# Altium schematic sheet STALO_1.SchDoc: STALO_1 (part 1 of 2)
size D; Date: 09-24-10; DrawnBy: C. Lewis; Engineer: C. Lewis; Address1: 4650 NORRIS CANYON RD.; Address2: SAN RAMON, CA 94583; DocumentNumber: 35133; Revision: D; SheetNumber: 18; SheetTotal: 20; PageSetup: Record=PageOptions|CenterHorizontal=True|CenterVertical=True|PrintScale=0.51|XCorrection=1.00|YCorrection=1.00|PrintKind=1|BorderSize=5000000|LeftOffset=0|BottomOffset=0|Orientation=2|PaperLength=1000|PaperWidth=1000|Scale=100|PaperSource=15|PrintQuality=600|MediaType=1|DitherType=10|PaperKind=11x17|PrintScaleMode=1; DocumentName: Sheet1.SCHDOC; ModifiedDate: 10-27-11
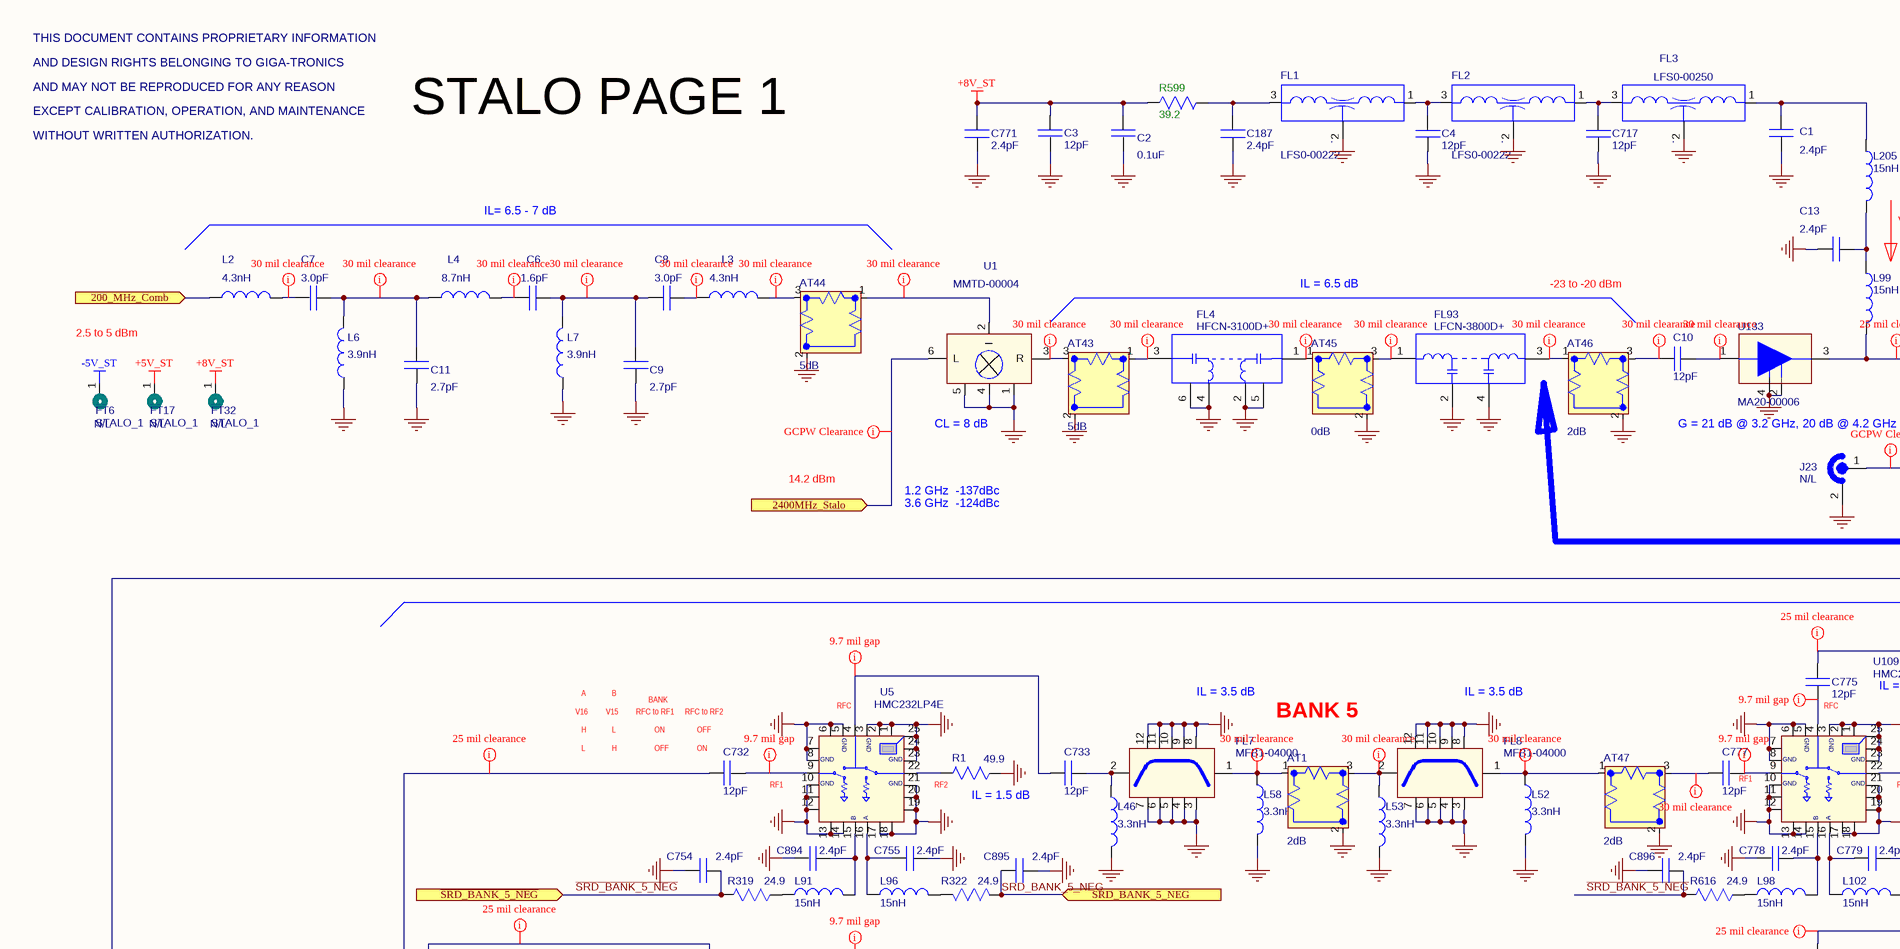
[diagram p0: STALO_1.SchDoc, top left]
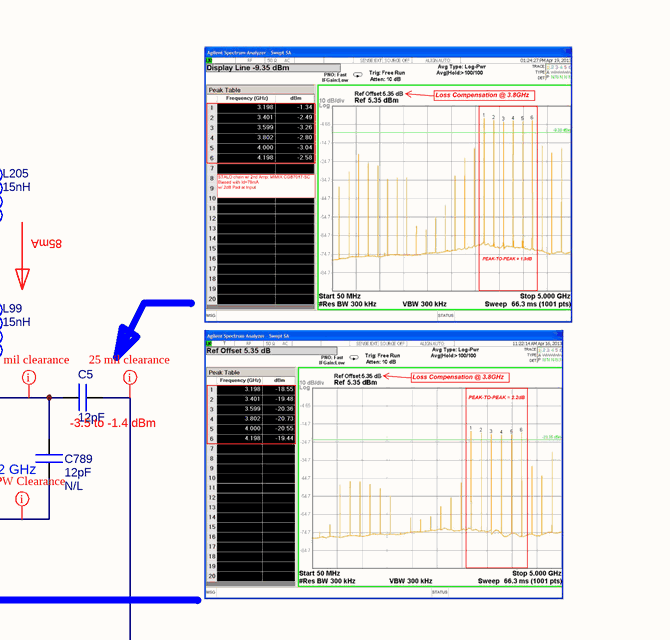
[diagram p1: STALO_1.SchDoc, top right]
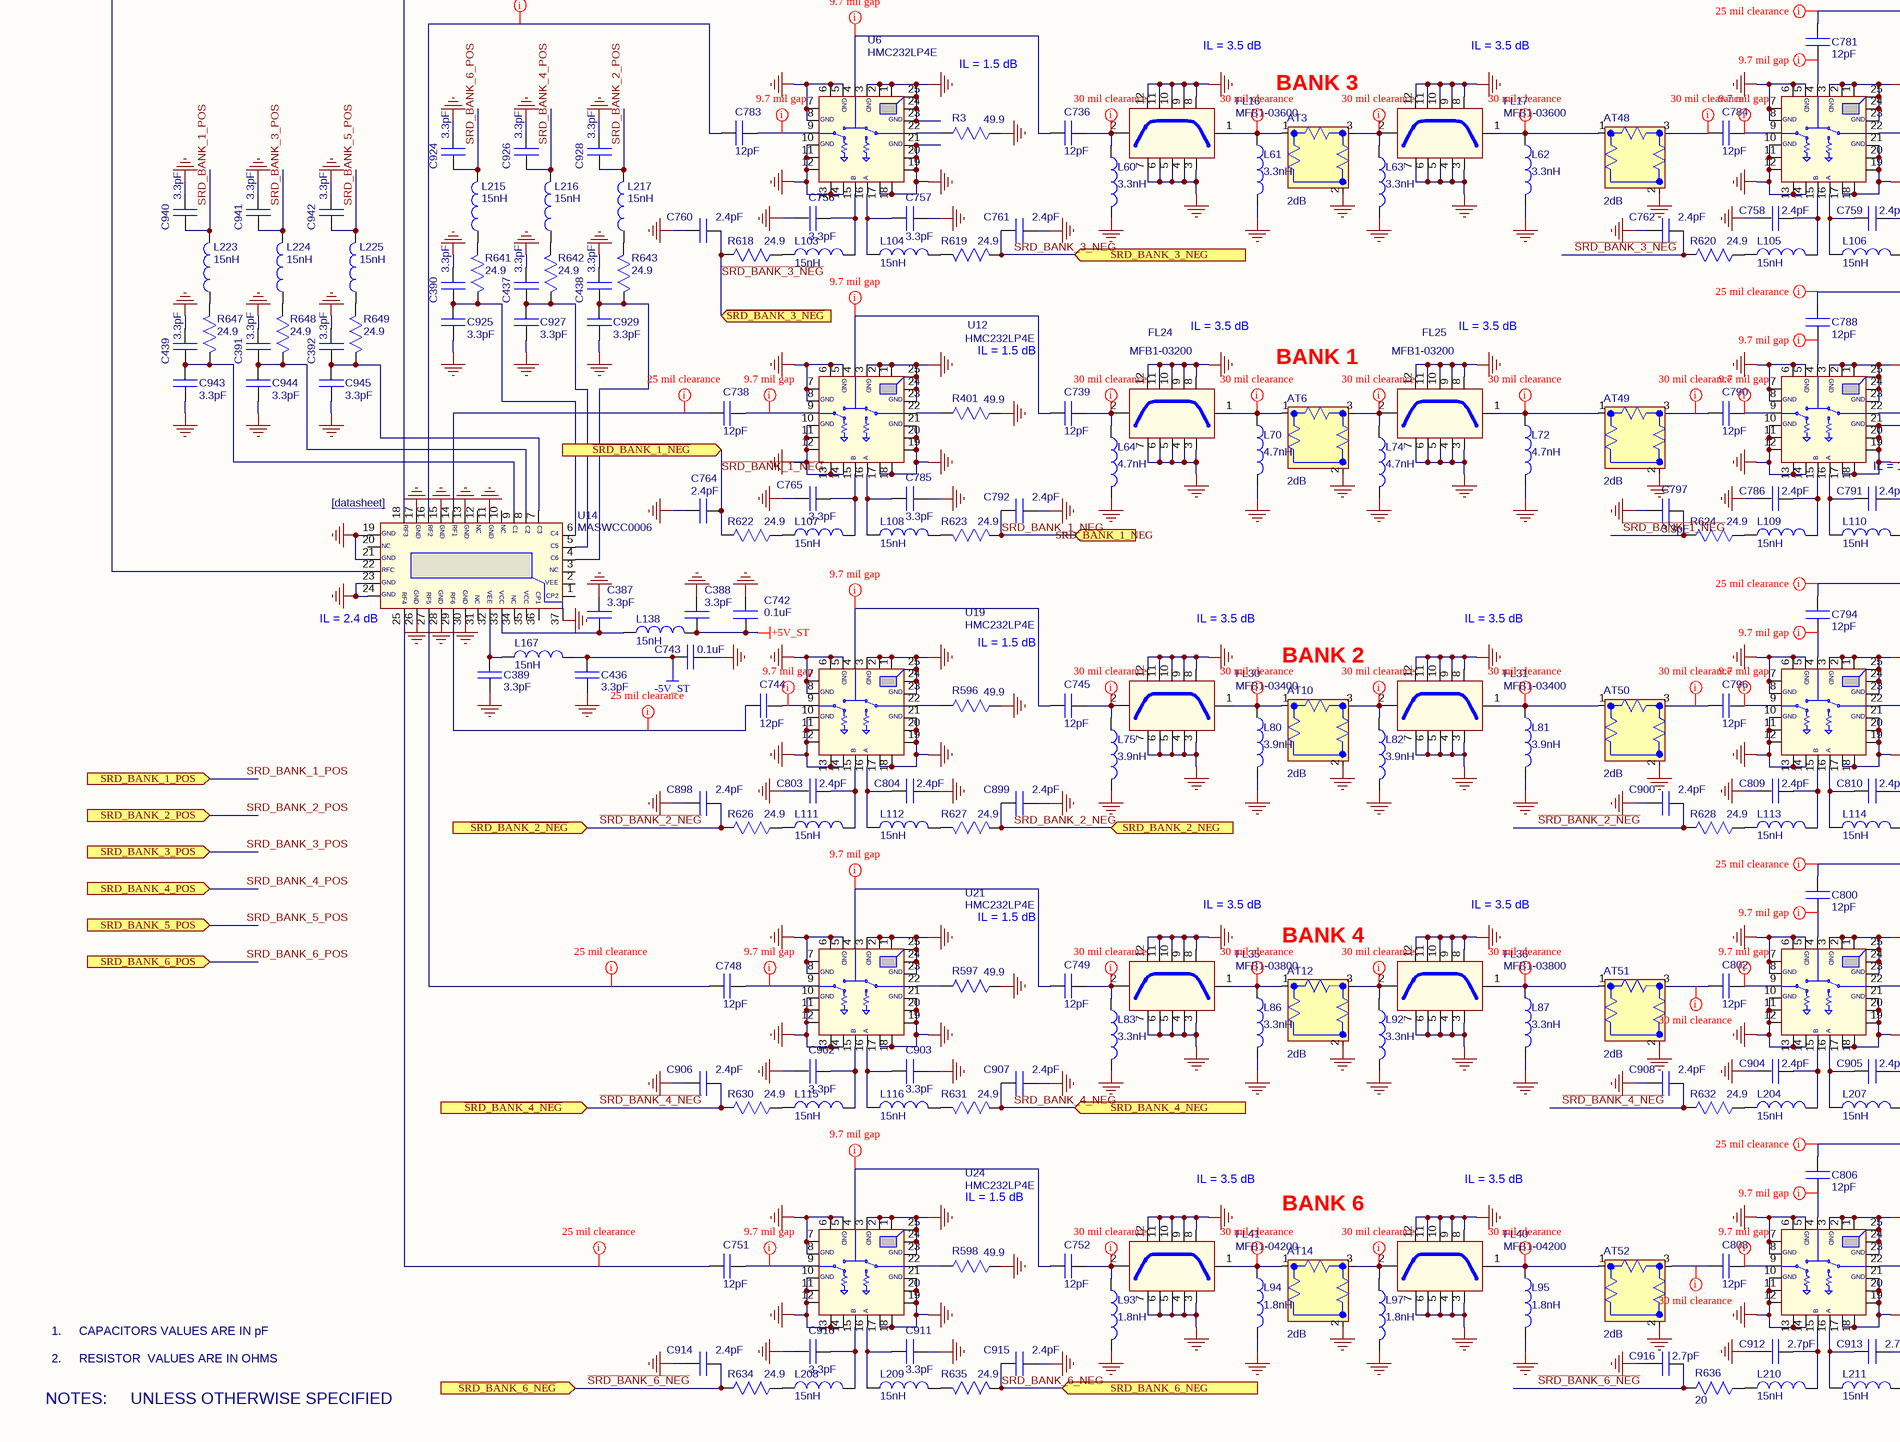
[diagram p2: STALO_1.SchDoc, bottom left]
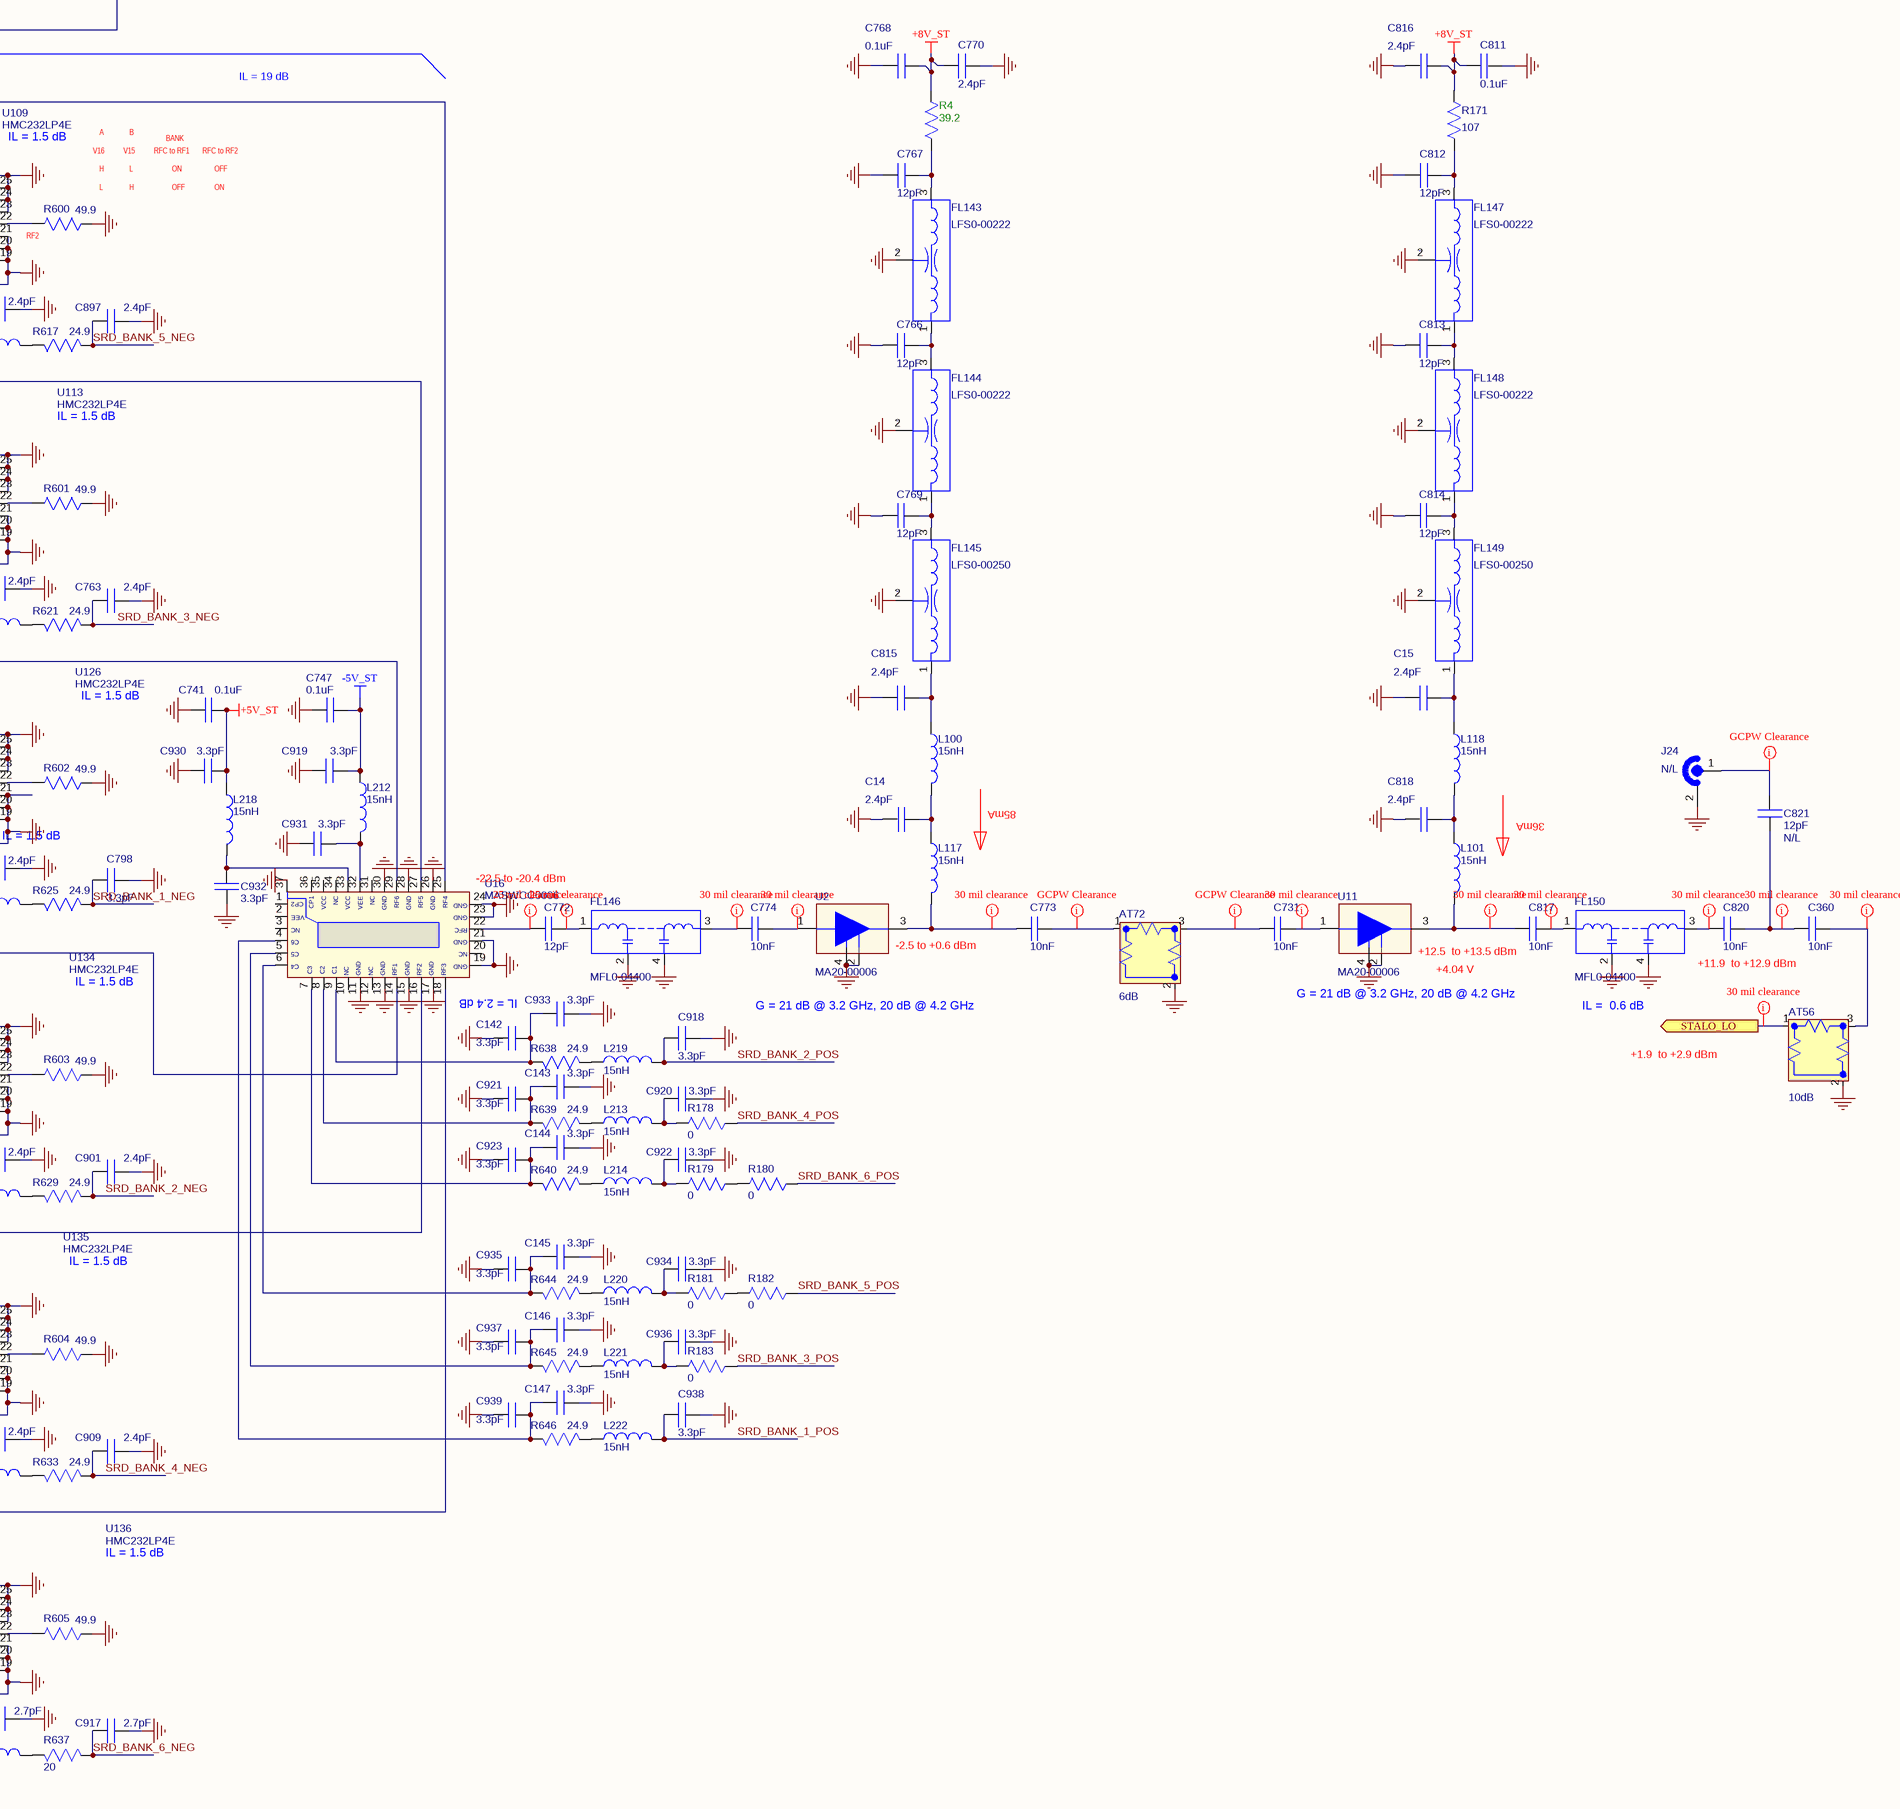
[diagram p3: STALO_1.SchDoc, bottom right]

## Parts
AT1  value 2dB  [ATTN-IMS-0805]  (hidden comment: PAD;CHIP;2dB;+/-.3dB;.08 x .05;50 OHM;FACE DOWN)
AT3  value 2dB  [ATTN-IMS-0805]  (hidden comment: PAD;CHIP;2dB;+/-.3dB;.08 x .05;50 OHM;FACE DOWN)
AT6  value 2dB  [ATTN-IMS-0805]  (hidden comment: PAD;CHIP;2dB;+/-.3dB;.08 x .05;50 OHM;FACE DOWN)
AT10  value 2dB  [ATTN-IMS-0805]  (hidden comment: PAD;CHIP;2dB;+/-.3dB;.08 x .05;50 OHM;FACE DOWN)
AT12  value 2dB  [ATTN-IMS-0805]  (hidden comment: PAD;CHIP;2dB;+/-.3dB;.08 x .05;50 OHM;FACE DOWN)
AT14  value 2dB  [ATTN-IMS-0805]  (hidden comment: PAD;CHIP;2dB;+/-.3dB;.08 x .05;50 OHM;FACE DOWN)
AT43  value 5dB  [ATTN-IMS-0805]  (hidden comment: PAD;CHIP;5dB;+/-.3dB;.08 x .05;50 OHM;FACE DOWN)
AT44  value 5dB  [ATTN-IMS-0805]  (hidden comment: PAD;CHIP;5dB;+/-.3dB;.08 x .05;50 OHM;FACE DOWN)
AT45  value 0dB  [ATTN-IMS-0805]  (hidden comment: PAD;CHIP;0dB;+/-.3dB;.08 x .05;50 OHM;FACE DOWN)
AT46  value 2dB  [ATTN-IMS-0805]  (hidden comment: PAD;CHIP;2dB;+/-.3dB;.08 x .05;50 OHM;FACE DOWN)
AT47  value 2dB  [ATTN-IMS-0805]  (hidden comment: PAD;CHIP;2dB;+/-.3dB;.08 x .05;50 OHM;FACE DOWN)
AT48  value 2dB  [ATTN-IMS-0805]  (hidden comment: PAD;CHIP;2dB;+/-.3dB;.08 x .05;50 OHM;FACE DOWN)
AT49  value 2dB  [ATTN-IMS-0805]  (hidden comment: PAD;CHIP;2dB;+/-.3dB;.08 x .05;50 OHM;FACE DOWN)
AT50  value 2dB  [ATTN-IMS-0805]  (hidden comment: PAD;CHIP;2dB;+/-.3dB;.08 x .05;50 OHM;FACE DOWN)
AT51  value 2dB  [ATTN-IMS-0805]  (hidden comment: PAD;CHIP;2dB;+/-.3dB;.08 x .05;50 OHM;FACE DOWN)
AT52  value 2dB  [ATTN-IMS-0805]  (hidden comment: PAD;CHIP;2dB;+/-.3dB;.08 x .05;50 OHM;FACE DOWN)
AT56  value 10dB  [ATTN-IMS-0805]  (hidden comment: PAD;CHIP;10dB;+/-.3dB;.08 x .05;50 OHM;FACE DOWN)
AT72  value 6dB  [ATTN-IMS-0805]  (hidden comment: PAD;CHIP;6dB;+/-.3dB;.08 x .05;50 OHM;FACE DOWN)
C1  value 2.4pF  [CAP-0402-RF]  (hidden comment: 2.4 PF;200V;.05PF;HIGH Q;SMT;CERAMIC;0402)
C2  value 0.1uF  [CAP-0603-H035-N]  (hidden comment: .1UF;10%;X7R;16V;CHIP;0603)
C3  value 12pF  [CAP-0402-N]  (hidden comment: 12 PF;5%;COG;>50V;CHIP;0402)
C4  value 12pF  [CAP-0402-N]  (hidden comment: 12 PF;5%;COG;>50V;CHIP;0402)
C5  value 12pF  [CAP-0402-N]  (hidden comment: 12 PF;5%;COG;>50V;CHIP;0402)
C6  value 1.6pF  [CAP-0402-RF]  (hidden comment: 1.6 PF;200V;.05PF;HIGH Q;SMT;CERAMIC;0402)
C7  value 3.0pF  [CAP-0402-RF]  (hidden comment: 3.0 PF;200V;.05PF;HIGH Q;SMT;CERAMIC;0402)
C8  value 3.0pF  [CAP-0402-RF]  (hidden comment: 3.0 PF;200V;.05PF;HIGH Q;SMT;CERAMIC;0402)
C9  value 2.7pF  [CAP-0402-RF]  (hidden comment: 2.7 PF;200V;.05PF;HIGH Q;SMT;CERAMIC;0402)
C10  value 12pF  [CAP-0402-N]  (hidden comment: 12 PF;5%;COG;>50V;CHIP;0402)
C11  value 2.7pF  [CAP-0402-RF]  (hidden comment: 2.7 PF;200V;.05PF;HIGH Q;SMT;CERAMIC;0402)
C13  value 2.4pF  [CAP-0402-RF]  (hidden comment: 2.4 PF;200V;.05PF;HIGH Q;SMT;CERAMIC;0402)
C14  value 2.4pF  [CAP-0402-RF]  (hidden comment: 2.4 PF;200V;.05PF;HIGH Q;SMT;CERAMIC;0402)
C15  value 2.4pF  [CAP-0402-RF]  (hidden comment: 2.4 PF;200V;.05PF;HIGH Q;SMT;CERAMIC;0402)
C142  value 3.3pF  [CAP-0201-N]  (hidden comment: 3.3pF;5%;COG;50V;CHIP;0201)
C143  value 3.3pF  [CAP-0201-N]  (hidden comment: 3.3pF;5%;COG;50V;CHIP;0201)
C144  value 3.3pF  [CAP-0201-N]  (hidden comment: 3.3pF;5%;COG;50V;CHIP;0201)
C145  value 3.3pF  [CAP-0201-N]  (hidden comment: 3.3pF;5%;COG;50V;CHIP;0201)
C146  value 3.3pF  [CAP-0201-N]  (hidden comment: 3.3pF;5%;COG;50V;CHIP;0201)
C147  value 3.3pF  [CAP-0201-N]  (hidden comment: 3.3pF;5%;COG;50V;CHIP;0201)
C187  value 2.4pF  [CAP-0402-RF]  (hidden comment: 2.4 PF;200V;.05PF;HIGH Q;SMT;CERAMIC;0402)
C360  value 10nF  [CAP-0402-N]  (hidden comment: 10nF;10%;X7R;16 WVDC;CHIP;0402)
C387  value 3.3pF  [CAP-0201-N]  (hidden comment: 3.3pF;5%;COG;50V;CHIP;0201)
C388  value 3.3pF  [CAP-0201-N]  (hidden comment: 3.3pF;5%;COG;50V;CHIP;0201)
C389  value 3.3pF  [CAP-0201-N]  (hidden comment: 3.3pF;5%;COG;50V;CHIP;0201)
C390  value 3.3pF  [CAP-0201-N]  (hidden comment: 3.3pF;5%;COG;50V;CHIP;0201)
C391  value 3.3pF  [CAP-0201-N]  (hidden comment: 3.3pF;5%;COG;50V;CHIP;0201)
C392  value 3.3pF  [CAP-0201-N]  (hidden comment: 3.3pF;5%;COG;50V;CHIP;0201)
C436  value 3.3pF  [CAP-0201-N]  (hidden comment: 3.3pF;5%;COG;50V;CHIP;0201)
C437  value 3.3pF  [CAP-0201-N]  (hidden comment: 3.3pF;5%;COG;50V;CHIP;0201)
C438  value 3.3pF  [CAP-0201-N]  (hidden comment: 3.3pF;5%;COG;50V;CHIP;0201)
C439  value 3.3pF  [CAP-0201-N]  (hidden comment: 3.3pF;5%;COG;50V;CHIP;0201)
C717  value 12pF  [CAP-0402-N]  (hidden comment: 12 PF;5%;COG;>50V;CHIP;0402)
C731  value 10nF  [CAP-0402-N]  (hidden comment: 10nF;10%;X7R;16 WVDC;CHIP;0402)
C732  value 12pF  [CAP-0402-N]  (hidden comment: 12 PF;5%;COG;>50V;CHIP;0402)
C733  value 12pF  [CAP-0402-N]  (hidden comment: 12 PF;5%;COG;>50V;CHIP;0402)
C736  value 12pF  [CAP-0402-N]  (hidden comment: 12 PF;5%;COG;>50V;CHIP;0402)
C738  value 12pF  [CAP-0402-N]  (hidden comment: 12 PF;5%;COG;>50V;CHIP;0402)
C739  value 12pF  [CAP-0402-N]  (hidden comment: 12 PF;5%;COG;>50V;CHIP;0402)
C741  value 0.1uF  [CAP-0402-N]  (hidden comment: .1 UF,10%;X7R;16V,CHIP;0402)
C742  value 0.1uF  [CAP-0402-N]  (hidden comment: .1 UF,10%;X7R;16V,CHIP;0402)
C743  value 0.1uF  [CAP-0402-N]  (hidden comment: .1 UF,10%;X7R;16V,CHIP;0402)
C744  value 12pF  [CAP-0402-N]  (hidden comment: 12 PF;5%;COG;>50V;CHIP;0402)
C745  value 12pF  [CAP-0402-N]  (hidden comment: 12 PF;5%;COG;>50V;CHIP;0402)
C747  value 0.1uF  [CAP-0402-N]  (hidden comment: .1 UF,10%;X7R;16V,CHIP;0402)
C748  value 12pF  [CAP-0402-N]  (hidden comment: 12 PF;5%;COG;>50V;CHIP;0402)
C749  value 12pF  [CAP-0402-N]  (hidden comment: 12 PF;5%;COG;>50V;CHIP;0402)
C751  value 12pF  [CAP-0402-N]  (hidden comment: 12 PF;5%;COG;>50V;CHIP;0402)
C752  value 12pF  [CAP-0402-N]  (hidden comment: 12 PF;5%;COG;>50V;CHIP;0402)
C754  value 2.4pF  [CAP-0402-RF]  (hidden comment: 2.4 PF;200V;.05PF;HIGH Q;SMT;CERAMIC;0402)
C755  value 2.4pF  [CAP-0402-RF]  (hidden comment: 2.4 PF;200V;.05PF;HIGH Q;SMT;CERAMIC;0402)
C756  value 3.3pF  [CAP-0201-N]  (hidden comment: 3.3pF;5%;COG;50V;CHIP;0201)
C757  value 3.3pF  [CAP-0201-N]  (hidden comment: 3.3pF;5%;COG;50V;CHIP;0201)
C758  value 2.4pF  [CAP-0402-RF]  (hidden comment: 2.4 PF;200V;.05PF;HIGH Q;SMT;CERAMIC;0402)
C759  value 2.4pF  [CAP-0402-RF]  (hidden comment: 2.4 PF;200V;.05PF;HIGH Q;SMT;CERAMIC;0402)
C760  value 2.4pF  [CAP-0402-RF]  (hidden comment: 2.4 PF;200V;.05PF;HIGH Q;SMT;CERAMIC;0402)
C761  value 2.4pF  [CAP-0402-RF]  (hidden comment: 2.4 PF;200V;.05PF;HIGH Q;SMT;CERAMIC;0402)
C762  value 2.4pF  [CAP-0402-RF]  (hidden comment: 2.4 PF;200V;.05PF;HIGH Q;SMT;CERAMIC;0402)
C763  value 2.4pF  [CAP-0402-RF]  (hidden comment: 2.4 PF;200V;.05PF;HIGH Q;SMT;CERAMIC;0402)
C764  value 2.4pF  [CAP-0402-RF]  (hidden comment: 2.4 PF;200V;.05PF;HIGH Q;SMT;CERAMIC;0402)
C765  value 3.3pF  [CAP-0201-N]  (hidden comment: 3.3pF;5%;COG;50V;CHIP;0201)
C766  value 12pF  [CAP-0402-N]  (hidden comment: 12 PF;5%;COG;>50V;CHIP;0402)
C767  value 12pF  [CAP-0402-N]  (hidden comment: 12 PF;5%;COG;>50V;CHIP;0402)
C768  value 0.1uF  [CAP-0603-H035-N]  (hidden comment: .1UF;10%;X7R;16V;CHIP;0603)
C769  value 12pF  [CAP-0402-N]  (hidden comment: 12 PF;5%;COG;>50V;CHIP;0402)
C770  value 2.4pF  [CAP-0402-RF]  (hidden comment: 2.4 PF;200V;.05PF;HIGH Q;SMT;CERAMIC;0402)
C771  value 2.4pF  [CAP-0402-RF]  (hidden comment: 2.4 PF;200V;.05PF;HIGH Q;SMT;CERAMIC;0402)
C772  value 12pF  [CAP-0402-N]  (hidden comment: 12 PF;5%;COG;>50V;CHIP;0402)
C773  value 10nF  [CAP-0402-N]  (hidden comment: 10nF;10%;X7R;16 WVDC;CHIP;0402)
C774  value 10nF  [CAP-0402-N]  (hidden comment: 10nF;10%;X7R;16 WVDC;CHIP;0402)
C775  value 12pF  [CAP-0402-N]  (hidden comment: 12 PF;5%;COG;>50V;CHIP;0402)
C777  value 12pF  [CAP-0402-N]  (hidden comment: 12 PF;5%;COG;>50V;CHIP;0402)
C778  value 2.4pF  [CAP-0402-RF]  (hidden comment: 2.4 PF;200V;.05PF;HIGH Q;SMT;CERAMIC;0402)
C779  value 2.4pF  [CAP-0402-RF]  (hidden comment: 2.4 PF;200V;.05PF;HIGH Q;SMT;CERAMIC;0402)
C781  value 12pF  [CAP-0402-N]  (hidden comment: 12 PF;5%;COG;>50V;CHIP;0402)
C783  value 12pF  [CAP-0402-N]  (hidden comment: 12 PF;5%;COG;>50V;CHIP;0402)
C784  value 12pF  [CAP-0402-N]  (hidden comment: 12 PF;5%;COG;>50V;CHIP;0402)
C785  value 3.3pF  [CAP-0201-N]  (hidden comment: 3.3pF;5%;COG;50V;CHIP;0201)
C786  value 2.4pF  [CAP-0402-RF]  (hidden comment: 2.4 PF;200V;.05PF;HIGH Q;SMT;CERAMIC;0402)
C788  value 12pF  [CAP-0402-N]  (hidden comment: 12 PF;5%;COG;>50V;CHIP;0402)
C789  value 12pF  NoLoad: N/L  [CAP-0402-N]  (hidden comment: 12 PF;5%;COG;>50V;CHIP;0402)
C790  value 12pF  [CAP-0402-N]  (hidden comment: 12 PF;5%;COG;>50V;CHIP;0402)
C791  value 2.4pF  [CAP-0402-RF]  (hidden comment: 2.4 PF;200V;.05PF;HIGH Q;SMT;CERAMIC;0402)
C792  value 2.4pF  [CAP-0402-RF]  (hidden comment: 2.4 PF;200V;.05PF;HIGH Q;SMT;CERAMIC;0402)
C794  value 12pF  [CAP-0402-N]  (hidden comment: 12 PF;5%;COG;>50V;CHIP;0402)
C796  value 12pF  [CAP-0402-N]  (hidden comment: 12 PF;5%;COG;>50V;CHIP;0402)
C797  value 3.3pF  [CAP-0201-N]  (hidden comment: 3.3pF;5%;COG;50V;CHIP;0201)
C798  value 3.3pF  [CAP-0201-N]  (hidden comment: 3.3pF;5%;COG;50V;CHIP;0201)
C800  value 12pF  [CAP-0402-N]  (hidden comment: 12 PF;5%;COG;>50V;CHIP;0402)
C802  value 12pF  [CAP-0402-N]  (hidden comment: 12 PF;5%;COG;>50V;CHIP;0402)
C803  value 2.4pF  [CAP-0402-RF]  (hidden comment: 2.4 PF;200V;.05PF;HIGH Q;SMT;CERAMIC;0402)
C804  value 2.4pF  [CAP-0402-RF]  (hidden comment: 2.4 PF;200V;.05PF;HIGH Q;SMT;CERAMIC;0402)
C806  value 12pF  [CAP-0402-N]  (hidden comment: 12 PF;5%;COG;>50V;CHIP;0402)
C808  value 12pF  [CAP-0402-N]  (hidden comment: 12 PF;5%;COG;>50V;CHIP;0402)
C809  value 2.4pF  [CAP-0402-RF]  (hidden comment: 2.4 PF;200V;.05PF;HIGH Q;SMT;CERAMIC;0402)
C810  value 2.4pF  [CAP-0402-RF]  (hidden comment: 2.4 PF;200V;.05PF;HIGH Q;SMT;CERAMIC;0402)
C811  value 0.1uF  [CAP-0603-H035-N]  (hidden comment: .1UF;10%;X7R;16V;CHIP;0603)
C812  value 12pF  [CAP-0402-N]  (hidden comment: 12 PF;5%;COG;>50V;CHIP;0402)
C813  value 12pF  [CAP-0402-N]  (hidden comment: 12 PF;5%;COG;>50V;CHIP;0402)
C814  value 12pF  [CAP-0402-N]  (hidden comment: 12 PF;5%;COG;>50V;CHIP;0402)
C815  value 2.4pF  [CAP-0402-RF]  (hidden comment: 2.4 PF;200V;.05PF;HIGH Q;SMT;CERAMIC;0402)
C816  value 2.4pF  [CAP-0402-RF]  (hidden comment: 2.4 PF;200V;.05PF;HIGH Q;SMT;CERAMIC;0402)
C817  value 10nF  [CAP-0402-N]  (hidden comment: 10nF;10%;X7R;16 WVDC;CHIP;0402)
C818  value 2.4pF  [CAP-0402-RF]  (hidden comment: 2.4 PF;200V;.05PF;HIGH Q;SMT;CERAMIC;0402)
C820  value 10nF  [CAP-0402-N]  (hidden comment: 10nF;10%;X7R;16 WVDC;CHIP;0402)
C821  value 12pF  NoLoad: N/L  [CAP-0402-N]  (hidden comment: 12 PF;5%;COG;>50V;CHIP;0402)
C894  value 2.4pF  [CAP-0402-RF]  (hidden comment: 2.4 PF;200V;.05PF;HIGH Q;SMT;CERAMIC;0402)
C895  value 2.4pF  [CAP-0402-RF]  (hidden comment: 2.4 PF;200V;.05PF;HIGH Q;SMT;CERAMIC;0402)
C896  value 2.4pF  [CAP-0402-RF]  (hidden comment: 2.4 PF;200V;.05PF;HIGH Q;SMT;CERAMIC;0402)
C897  value 2.4pF  [CAP-0402-RF]  (hidden comment: 2.4 PF;200V;.05PF;HIGH Q;SMT;CERAMIC;0402)
C898  value 2.4pF  [CAP-0402-RF]  (hidden comment: 2.4 PF;200V;.05PF;HIGH Q;SMT;CERAMIC;0402)
C899  value 2.4pF  [CAP-0402-RF]  (hidden comment: 2.4 PF;200V;.05PF;HIGH Q;SMT;CERAMIC;0402)
C900  value 2.4pF  [CAP-0402-RF]  (hidden comment: 2.4 PF;200V;.05PF;HIGH Q;SMT;CERAMIC;0402)
C901  value 2.4pF  [CAP-0402-RF]  (hidden comment: 2.4 PF;200V;.05PF;HIGH Q;SMT;CERAMIC;0402)
C902  value 3.3pF  [CAP-0201-N]  (hidden comment: 3.3pF;5%;COG;50V;CHIP;0201)
C903  value 3.3pF  [CAP-0201-N]  (hidden comment: 3.3pF;5%;COG;50V;CHIP;0201)
C904  value 2.4pF  [CAP-0402-RF]  (hidden comment: 2.4 PF;200V;.05PF;HIGH Q;SMT;CERAMIC;0402)
C905  value 2.4pF  [CAP-0402-RF]  (hidden comment: 2.4 PF;200V;.05PF;HIGH Q;SMT;CERAMIC;0402)
C906  value 2.4pF  [CAP-0402-RF]  (hidden comment: 2.4 PF;200V;.05PF;HIGH Q;SMT;CERAMIC;0402)
C907  value 2.4pF  [CAP-0402-RF]  (hidden comment: 2.4 PF;200V;.05PF;HIGH Q;SMT;CERAMIC;0402)
C908  value 2.4pF  [CAP-0402-RF]  (hidden comment: 2.4 PF;200V;.05PF;HIGH Q;SMT;CERAMIC;0402)
C909  value 2.4pF  [CAP-0402-RF]  (hidden comment: 2.4 PF;200V;.05PF;HIGH Q;SMT;CERAMIC;0402)
C910  value 3.3pF  [CAP-0201-N]  (hidden comment: 3.3pF;5%;COG;50V;CHIP;0201)
C911  value 3.3pF  [CAP-0201-N]  (hidden comment: 3.3pF;5%;COG;50V;CHIP;0201)
C912  value 2.7pF  [CAP-0201-N]  (hidden comment: 2.7pF;5%;COG;50V;CHIP;0201)
C913  value 2.7pF  [CAP-0201-N]  (hidden comment: 2.7pF;5%;COG;50V;CHIP;0201)
C914  value 2.4pF  [CAP-0402-RF]  (hidden comment: 2.4 PF;200V;.05PF;HIGH Q;SMT;CERAMIC;0402)
C915  value 2.4pF  [CAP-0402-RF]  (hidden comment: 2.4 PF;200V;.05PF;HIGH Q;SMT;CERAMIC;0402)
C916  value 2.7pF  [CAP-0201-N]  (hidden comment: 2.7pF;5%;COG;50V;CHIP;0201)
C917  value 2.7pF  [CAP-0201-N]  (hidden comment: 2.7pF;5%;COG;50V;CHIP;0201)
C918  value 3.3pF  [CAP-0201-N]  (hidden comment: 3.3pF;5%;COG;50V;CHIP;0201)
C919  value 3.3pF  [CAP-0201-N]  (hidden comment: 3.3pF;5%;COG;50V;CHIP;0201)
C920  value 3.3pF  [CAP-0201-N]  (hidden comment: 3.3pF;5%;COG;50V;CHIP;0201)
C921  value 3.3pF  [CAP-0201-N]  (hidden comment: 3.3pF;5%;COG;50V;CHIP;0201)
C922  value 3.3pF  [CAP-0201-N]  (hidden comment: 3.3pF;5%;COG;50V;CHIP;0201)
C923  value 3.3pF  [CAP-0201-N]  (hidden comment: 3.3pF;5%;COG;50V;CHIP;0201)
C924  value 3.3pF  [CAP-0201-N]  (hidden comment: 3.3pF;5%;COG;50V;CHIP;0201)
C925  value 3.3pF  [CAP-0201-N]  (hidden comment: 3.3pF;5%;COG;50V;CHIP;0201)
C926  value 3.3pF  [CAP-0201-N]  (hidden comment: 3.3pF;5%;COG;50V;CHIP;0201)
C927  value 3.3pF  [CAP-0201-N]  (hidden comment: 3.3pF;5%;COG;50V;CHIP;0201)
C928  value 3.3pF  [CAP-0201-N]  (hidden comment: 3.3pF;5%;COG;50V;CHIP;0201)
C929  value 3.3pF  [CAP-0201-N]  (hidden comment: 3.3pF;5%;COG;50V;CHIP;0201)
C930  value 3.3pF  [CAP-0201-N]  (hidden comment: 3.3pF;5%;COG;50V;CHIP;0201)
C931  value 3.3pF  [CAP-0201-N]  (hidden comment: 3.3pF;5%;COG;50V;CHIP;0201)
C932  value 3.3pF  [CAP-0201-N]  (hidden comment: 3.3pF;5%;COG;50V;CHIP;0201)
C933  value 3.3pF  [CAP-0201-N]  (hidden comment: 3.3pF;5%;COG;50V;CHIP;0201)
C934  value 3.3pF  [CAP-0201-N]  (hidden comment: 3.3pF;5%;COG;50V;CHIP;0201)
C935  value 3.3pF  [CAP-0201-N]  (hidden comment: 3.3pF;5%;COG;50V;CHIP;0201)
C936  value 3.3pF  [CAP-0201-N]  (hidden comment: 3.3pF;5%;COG;50V;CHIP;0201)
C937  value 3.3pF  [CAP-0201-N]  (hidden comment: 3.3pF;5%;COG;50V;CHIP;0201)
C938  value 3.3pF  [CAP-0201-N]  (hidden comment: 3.3pF;5%;COG;50V;CHIP;0201)
C939  value 3.3pF  [CAP-0201-N]  (hidden comment: 3.3pF;5%;COG;50V;CHIP;0201)
C940  value 3.3pF  [CAP-0201-N]  (hidden comment: 3.3pF;5%;COG;50V;CHIP;0201)
C941  value 3.3pF  [CAP-0201-N]  (hidden comment: 3.3pF;5%;COG;50V;CHIP;0201)
C942  value 3.3pF  [CAP-0201-N]  (hidden comment: 3.3pF;5%;COG;50V;CHIP;0201)
C943  value 3.3pF  [CAP-0201-N]  (hidden comment: 3.3pF;5%;COG;50V;CHIP;0201)
C944  value 3.3pF  [CAP-0201-N]  (hidden comment: 3.3pF;5%;COG;50V;CHIP;0201)
C945  value 3.3pF  [CAP-0201-N]  (hidden comment: 3.3pF;5%;COG;50V;CHIP;0201)
FL1  Filter EMI 2200PF,1206  [FIL-NFE31P-1206-4P]  (value not drawn)
FL2  Filter EMI 2200PF,1206  [FIL-NFE31P-1206-4P]  (value not drawn)
FL3  F/T FILTER;CHIP;2.5 DCR150MA;16V;T LC;25PF;200MHz;0603  [FIL-NFL18ST]  (value not drawn)
FL4  M_PN: HFCN-3100D+  [FV1206-1]  (hidden comment: FILTER;HI PASS;3100MHz;5SEC;FV1206-1;RoHS)
FL7  FILTER;CER;BANDPASS;4000MHZ;70MHZ BW;6-SEC;SMT  [FIL-1060X380X240_2_10P]  (value not drawn)
FL8  FILTER;CER;BANDPASS;4000MHZ;70MHZ BW;6-SEC;SMT  [FIL-1060X380X240_2_10P]  (value not drawn)
FL16  4SD3600-U70-6CC  [FIL-1060X380X240_2_10P]  (value not drawn)
FL17  4SD3600-U70-6CC  [FIL-1060X380X240_2_10P]  (value not drawn)
FL24  FILTER;CER;BANDPASS;3200MHZ;70MHZ BW;6-SEC;SMT  [FIL-1060X380X240_2_10P]  (value not drawn)
FL25  FILTER;CER;BANDPASS;3200MHZ;70MHZ BW;6-SEC;SMT  [FIL-1060X380X240_2_10P]  (value not drawn)
FL30  FILTER;CER;BANDPASS;3400MHZ;70MHZ BW;6-SEC;SMT  [FIL-1060X380X240_2_10P]  (value not drawn)
FL31  FILTER;CER;BANDPASS;3400MHZ;70MHZ BW;6-SEC;SMT  [FIL-1060X380X240_2_10P]  (value not drawn)
FL35  FILTER;CER;BANDPASS;3800MHZ;70MHZ BW;6-SEC;SMT  [FIL-1060X380X240_2_10P]  (value not drawn)
FL36  FILTER;CER;BANDPASS;3800MHZ;70MHZ BW;6-SEC;SMT  [FIL-1060X380X240_2_10P]  (value not drawn)
FL40  FILTER;CER;BANDPASS;4200MHZ;70MHZ BW;6-SEC;SMT  [FIL-1060X380X240_2_10P]  (value not drawn)
FL41  FILTER;CER;BANDPASS;4200MHZ;70MHZ BW;6-SEC;SMT  [FIL-1060X380X240_2_10P]  (value not drawn)
FL93  M_PN: LFCN-3800D+  [FV1206]  (hidden comment: FILTER;LOW PASS;3900MHz;7SEC;RoHS;FV1206)
FL143  Filter EMI 2200PF,1206  [FIL-NFE31P-1206-4P]  (value not drawn)
FL144  Filter EMI 2200PF,1206  [FIL-NFE31P-1206-4P]  (value not drawn)
FL145  F/T FILTER;CHIP;2.5 DCR150MA;16V;T LC;25PF;200MHz;0603  [FIL-NFL18ST]  (value not drawn)
FL146  FILTER;LOW PASS;4400MHz;7SEC;FV1206  [FV1206]  (value not drawn)
FL147  Filter EMI 2200PF,1206  [FIL-NFE31P-1206-4P]  (value not drawn)
FL148  Filter EMI 2200PF,1206  [FIL-NFE31P-1206-4P]  (value not drawn)
FL149  F/T FILTER;CHIP;2.5 DCR150MA;16V;T LC;25PF;200MHz;0603  [FIL-NFL18ST]  (value not drawn)
FL150  FILTER;LOW PASS;4400MHz;7SEC;FV1206  [FV1206]  (value not drawn)
FT6  STALO_1  NoLoad: N/L  [FromToNode_ML2]  (net tie, no BOM)
FT17  STALO_1  NoLoad: N/L  [FromToNode_ML2]  (net tie, no BOM)
FT32  STALO_1  NoLoad: N/L  [FromToNode_ML2]  (net tie, no BOM)
J23  NoLoad: N/L  [JRSM-40101]  (hidden comment: SMPM;SB;MALE;STRAIGHT;SMT;.152X.152X.150;PCB;R/A CONTACT)
J24  NoLoad: N/L  [JRSM-40101]  (hidden comment: SMPM;SB;MALE;STRAIGHT;SMT;.152X.152X.150;PCB;R/A CONTACT)
L2  value 4.3nH  [IND-0603HP]  (hidden comment: INDUCTOR;4.3;2%;7.5GHZ SRF;91Q @1.7GHZ;.08 DCR;1.3A;0603)
L3  value 4.3nH  [IND-0603HP]  (hidden comment: INDUCTOR;4.3;2%;7.5GHZ SRF;91Q @1.7GHZ;.08 DCR;1.3A;0603)
L4  value 8.7nH  [IND-0603HP]  (hidden comment: INDUCTOR;8.7NH;2%;5.5G SRF;149Q @1.7G;.054 DCR;1.4A;0603)
L6  value 3.9nH  [IND-0603HP]  (hidden comment: INDUCTOR;3.9;2%;7.5GHZ SRF;108Q @1.7GHZ;.039 DCR;1.6A;0603)
L7  value 3.9nH  [IND-0603HP]  (hidden comment: INDUCTOR;3.9;2%;7.5GHZ SRF;108Q @1.7GHZ;.039 DCR;1.6A;0603)
L46  value 3.3nH  [IND-0603HP]  (hidden comment: INDUCTOR;3.3NH;2%;9.6G SRF;104Q @1.7G;.024 DCR;1.9A;0603)
L52  value 3.3nH  [IND-0603HP]  (hidden comment: INDUCTOR;3.3NH;2%;9.6G SRF;104Q @1.7G;.024 DCR;1.9A;0603)
L53  value 3.3nH  [IND-0603HP]  (hidden comment: INDUCTOR;3.3NH;2%;9.6G SRF;104Q @1.7G;.024 DCR;1.9A;0603)
L58  value 3.3nH  [IND-0603HP]  (hidden comment: INDUCTOR;3.3NH;2%;9.6G SRF;104Q @1.7G;.024 DCR;1.9A;0603)
L60  value 3.3nH  [IND-0603HP]  (hidden comment: INDUCTOR;3.3NH;2%;9.6G SRF;104Q @1.7G;.024 DCR;1.9A;0603)
L61  value 3.3nH  [IND-0603HP]  (hidden comment: INDUCTOR;3.3NH;2%;9.6G SRF;104Q @1.7G;.024 DCR;1.9A;0603)
L62  value 3.3nH  [IND-0603HP]  (hidden comment: INDUCTOR;3.3NH;2%;9.6G SRF;104Q @1.7G;.024 DCR;1.9A;0603)
L63  value 3.3nH  [IND-0603HP]  (hidden comment: INDUCTOR;3.3NH;2%;9.6G SRF;104Q @1.7G;.024 DCR;1.9A;0603)
L64  value 4.7nH  [IND-0603HP]  (hidden comment: INDUCTOR;4.7;2%;7.9GHZ SRF;75Q @1.7GHZ;.1 DCR;1.1A;0603)
L70  value 4.7nH  [IND-0603HP]  (hidden comment: INDUCTOR;4.7;2%;7.9GHZ SRF;75Q @1.7GHZ;.1 DCR;1.1A;0603)
L72  value 4.7nH  [IND-0603HP]  (hidden comment: INDUCTOR;4.7;2%;7.9GHZ SRF;75Q @1.7GHZ;.1 DCR;1.1A;0603)
L74  value 4.7nH  [IND-0603HP]  (hidden comment: INDUCTOR;4.7;2%;7.9GHZ SRF;75Q @1.7GHZ;.1 DCR;1.1A;0603)
L75  value 3.9nH  [IND-0603HP]  (hidden comment: INDUCTOR;3.9;2%;7.5GHZ SRF;108Q @1.7GHZ;.039 DCR;1.6A;0603)
L80  value 3.9nH  [IND-0603HP]  (hidden comment: INDUCTOR;3.9;2%;7.5GHZ SRF;108Q @1.7GHZ;.039 DCR;1.6A;0603)
L81  value 3.9nH  [IND-0603HP]  (hidden comment: INDUCTOR;3.9;2%;7.5GHZ SRF;108Q @1.7GHZ;.039 DCR;1.6A;0603)
L82  value 3.9nH  [IND-0603HP]  (hidden comment: INDUCTOR;3.9;2%;7.5GHZ SRF;108Q @1.7GHZ;.039 DCR;1.6A;0603)
L83  value 3.3nH  [IND-0603HP]  (hidden comment: INDUCTOR;3.3NH;2%;9.6G SRF;104Q @1.7G;.024 DCR;1.9A;0603)
L86  value 3.3nH  [IND-0603HP]  (hidden comment: INDUCTOR;3.3NH;2%;9.6G SRF;104Q @1.7G;.024 DCR;1.9A;0603)
L87  value 3.3nH  [IND-0603HP]  (hidden comment: INDUCTOR;3.3NH;2%;9.6G SRF;104Q @1.7G;.024 DCR;1.9A;0603)
L91  value 15nH  [IND-0402HP]  (hidden comment: INDUCTOR;15NH;2%;3.9GHZ SRF;85Q @1.7GHZ;.078 DCR;1.1A;0402)
L92  value 3.3nH  [IND-0603HP]  (hidden comment: INDUCTOR;3.3NH;2%;9.6G SRF;104Q @1.7G;.024 DCR;1.9A;0603)
L93  value 1.8nH  [IND-0603HP]  (hidden comment: INDUCTOR;1.8NH;5%;16G SRF;65Q @1.7G;.18 DCR;.033A;0603)
L94  value 1.8nH  [IND-0603HP]  (hidden comment: INDUCTOR;1.8NH;5%;16G SRF;65Q @1.7G;.18 DCR;.033A;0603)
L95  value 1.8nH  [IND-0603HP]  (hidden comment: INDUCTOR;1.8NH;5%;16G SRF;65Q @1.7G;.18 DCR;.033A;0603)
L96  value 15nH  [IND-0402HP]  (hidden comment: INDUCTOR;15NH;2%;3.9GHZ SRF;85Q @1.7GHZ;.078 DCR;1.1A;0402)
L97  value 1.8nH  [IND-0603HP]  (hidden comment: INDUCTOR;1.8NH;5%;16G SRF;65Q @1.7G;.18 DCR;.033A;0603)
L98  value 15nH  [IND-0402HP]  (hidden comment: INDUCTOR;15NH;2%;3.9GHZ SRF;85Q @1.7GHZ;.078 DCR;1.1A;0402)
L99  value 15nH  [IND-0402HP]  (hidden comment: INDUCTOR;15NH;2%;3.9GHZ SRF;85Q @1.7GHZ;.078 DCR;1.1A;0402)
L100  value 15nH  [IND-0402HP]  (hidden comment: INDUCTOR;15NH;2%;3.9GHZ SRF;85Q @1.7GHZ;.078 DCR;1.1A;0402)
L101  value 15nH  [IND-0402HP]  (hidden comment: INDUCTOR;15NH;2%;3.9GHZ SRF;85Q @1.7GHZ;.078 DCR;1.1A;0402)
L102  value 15nH  [IND-0402HP]  (hidden comment: INDUCTOR;15NH;2%;3.9GHZ SRF;85Q @1.7GHZ;.078 DCR;1.1A;0402)
L103  value 15nH  [IND-0402HP]  (hidden comment: INDUCTOR;15NH;2%;3.9GHZ SRF;85Q @1.7GHZ;.078 DCR;1.1A;0402)
L104  value 15nH  [IND-0402HP]  (hidden comment: INDUCTOR;15NH;2%;3.9GHZ SRF;85Q @1.7GHZ;.078 DCR;1.1A;0402)
L105  value 15nH  [IND-0402HP]  (hidden comment: INDUCTOR;15NH;2%;3.9GHZ SRF;85Q @1.7GHZ;.078 DCR;1.1A;0402)
L106  value 15nH  [IND-0402HP]  (hidden comment: INDUCTOR;15NH;2%;3.9GHZ SRF;85Q @1.7GHZ;.078 DCR;1.1A;0402)
L107  value 15nH  [IND-0402HP]  (hidden comment: INDUCTOR;15NH;2%;3.9GHZ SRF;85Q @1.7GHZ;.078 DCR;1.1A;0402)
L108  value 15nH  [IND-0402HP]  (hidden comment: INDUCTOR;15NH;2%;3.9GHZ SRF;85Q @1.7GHZ;.078 DCR;1.1A;0402)
L109  value 15nH  [IND-0402HP]  (hidden comment: INDUCTOR;15NH;2%;3.9GHZ SRF;85Q @1.7GHZ;.078 DCR;1.1A;0402)
L110  value 15nH  [IND-0402HP]  (hidden comment: INDUCTOR;15NH;2%;3.9GHZ SRF;85Q @1.7GHZ;.078 DCR;1.1A;0402)
L111  value 15nH  [IND-0402HP]  (hidden comment: INDUCTOR;15NH;2%;3.9GHZ SRF;85Q @1.7GHZ;.078 DCR;1.1A;0402)
L112  value 15nH  [IND-0402HP]  (hidden comment: INDUCTOR;15NH;2%;3.9GHZ SRF;85Q @1.7GHZ;.078 DCR;1.1A;0402)
L113  value 15nH  [IND-0402HP]  (hidden comment: INDUCTOR;15NH;2%;3.9GHZ SRF;85Q @1.7GHZ;.078 DCR;1.1A;0402)
L114  value 15nH  [IND-0402HP]  (hidden comment: INDUCTOR;15NH;2%;3.9GHZ SRF;85Q @1.7GHZ;.078 DCR;1.1A;0402)
L115  value 15nH  [IND-0402HP]  (hidden comment: INDUCTOR;15NH;2%;3.9GHZ SRF;85Q @1.7GHZ;.078 DCR;1.1A;0402)
L116  value 15nH  [IND-0402HP]  (hidden comment: INDUCTOR;15NH;2%;3.9GHZ SRF;85Q @1.7GHZ;.078 DCR;1.1A;0402)
L117  value 15nH  [IND-0402HP]  (hidden comment: INDUCTOR;15NH;2%;3.9GHZ SRF;85Q @1.7GHZ;.078 DCR;1.1A;0402)
L118  value 15nH  [IND-0402HP]  (hidden comment: INDUCTOR;15NH;2%;3.9GHZ SRF;85Q @1.7GHZ;.078 DCR;1.1A;0402)
L138  value 15nH  [IND-0402HP]  (hidden comment: INDUCTOR;15NH;2%;3.9GHZ SRF;85Q @1.7GHZ;.078 DCR;1.1A;0402)
L167  value 15nH  [IND-0402HP]  (hidden comment: INDUCTOR;15NH;2%;3.9GHZ SRF;85Q @1.7GHZ;.078 DCR;1.1A;0402)
L204  value 15nH  [IND-0402HP]  (hidden comment: INDUCTOR;15NH;2%;3.9GHZ SRF;85Q @1.7GHZ;.078 DCR;1.1A;0402)
L205  value 15nH  [IND-0402HP]  (hidden comment: INDUCTOR;15NH;2%;3.9GHZ SRF;85Q @1.7GHZ;.078 DCR;1.1A;0402)
L207  value 15nH  [IND-0402HP]  (hidden comment: INDUCTOR;15NH;2%;3.9GHZ SRF;85Q @1.7GHZ;.078 DCR;1.1A;0402)
L208  value 15nH  [IND-0402HP]  (hidden comment: INDUCTOR;15NH;2%;3.9GHZ SRF;85Q @1.7GHZ;.078 DCR;1.1A;0402)
L209  value 15nH  [IND-0402HP]  (hidden comment: INDUCTOR;15NH;2%;3.9GHZ SRF;85Q @1.7GHZ;.078 DCR;1.1A;0402)
L210  value 15nH  [IND-0402HP]  (hidden comment: INDUCTOR;15NH;2%;3.9GHZ SRF;85Q @1.7GHZ;.078 DCR;1.1A;0402)
L211  value 15nH  [IND-0402HP]  (hidden comment: INDUCTOR;15NH;2%;3.9GHZ SRF;85Q @1.7GHZ;.078 DCR;1.1A;0402)
L212  value 15nH  [IND-0402HP]  (hidden comment: INDUCTOR;15NH;2%;3.9GHZ SRF;85Q @1.7GHZ;.078 DCR;1.1A;0402)
L213  value 15nH  [IND-0402HP]  (hidden comment: INDUCTOR;15NH;2%;3.9GHZ SRF;85Q @1.7GHZ;.078 DCR;1.1A;0402)
L214  value 15nH  [IND-0402HP]  (hidden comment: INDUCTOR;15NH;2%;3.9GHZ SRF;85Q @1.7GHZ;.078 DCR;1.1A;0402)
L215  value 15nH  [IND-0402HP]  (hidden comment: INDUCTOR;15NH;2%;3.9GHZ SRF;85Q @1.7GHZ;.078 DCR;1.1A;0402)
L216  value 15nH  [IND-0402HP]  (hidden comment: INDUCTOR;15NH;2%;3.9GHZ SRF;85Q @1.7GHZ;.078 DCR;1.1A;0402)
L217  value 15nH  [IND-0402HP]  (hidden comment: INDUCTOR;15NH;2%;3.9GHZ SRF;85Q @1.7GHZ;.078 DCR;1.1A;0402)
L218  value 15nH  [IND-0402HP]  (hidden comment: INDUCTOR;15NH;2%;3.9GHZ SRF;85Q @1.7GHZ;.078 DCR;1.1A;0402)
L219  value 15nH  [IND-0402HP]  (hidden comment: INDUCTOR;15NH;2%;3.9GHZ SRF;85Q @1.7GHZ;.078 DCR;1.1A;0402)
L220  value 15nH  [IND-0402HP]  (hidden comment: INDUCTOR;15NH;2%;3.9GHZ SRF;85Q @1.7GHZ;.078 DCR;1.1A;0402)
L221  value 15nH  [IND-0402HP]  (hidden comment: INDUCTOR;15NH;2%;3.9GHZ SRF;85Q @1.7GHZ;.078 DCR;1.1A;0402)
L222  value 15nH  [IND-0402HP]  (hidden comment: INDUCTOR;15NH;2%;3.9GHZ SRF;85Q @1.7GHZ;.078 DCR;1.1A;0402)
L223  value 15nH  [IND-0402HP]  (hidden comment: INDUCTOR;15NH;2%;3.9GHZ SRF;85Q @1.7GHZ;.078 DCR;1.1A;0402)
L224  value 15nH  [IND-0402HP]  (hidden comment: INDUCTOR;15NH;2%;3.9GHZ SRF;85Q @1.7GHZ;.078 DCR;1.1A;0402)
L225  value 15nH  [IND-0402HP]  (hidden comment: INDUCTOR;15NH;2%;3.9GHZ SRF;85Q @1.7GHZ;.078 DCR;1.1A;0402)
R1  value 49.9  [RES-0402-N]  (hidden comment: 49.9 OHMS;.06W;1%;200PPM;FILM;CHIP;0402)
R3  value 49.9  [RES-0402-N]  (hidden comment: 49.9 OHMS;.06W;1%;200PPM;FILM;CHIP;0402)
R4  value 39.2  [RES-2010-N]  (hidden comment: 39.2 OHM;.75W;1%;100PPM;FILM CHIP;2010)
R171  value 107  [RES-2010-N]  (hidden comment: 107 OHMS;0.75W;1%;100PPM;THICK FILM;CHIP;2010;RoHS)
R178  value 0  [RES-0603-N]  (hidden comment: JUMPER;.05 OHMS MAX;1A MAX;0603)
R179  value 0  [RES-0603-N]  (hidden comment: JUMPER;.05 OHMS MAX;1A MAX;0603)
R180  value 0  [RES-0603-N]  (hidden comment: JUMPER;.05 OHMS MAX;1A MAX;0603)
R181  value 0  [RES-0603-N]  (hidden comment: JUMPER;.05 OHMS MAX;1A MAX;0603)
R182  value 0  [RES-0603-N]  (hidden comment: JUMPER;.05 OHMS MAX;1A MAX;0603)
R183  value 0  [RES-0603-N]  (hidden comment: JUMPER;.05 OHMS MAX;1A MAX;0603)
R319  value 24.9  [RES-0402-N]  (hidden comment: 24.9 OHMS;.06W;1%;200PPM;FILM;CHIP;0402)
R322  value 24.9  [RES-0402-N]  (hidden comment: 24.9 OHMS;.06W;1%;200PPM;FILM;CHIP;0402)
R401  value 49.9  [RES-0402-N]  (hidden comment: 49.9 OHMS;.06W;1%;200PPM;FILM;CHIP;0402)
R596  value 49.9  [RES-0402-N]  (hidden comment: 49.9 OHMS;.06W;1%;200PPM;FILM;CHIP;0402)
R597  value 49.9  [RES-0402-N]  (hidden comment: 49.9 OHMS;.06W;1%;200PPM;FILM;CHIP;0402)
R598  value 49.9  [RES-0402-N]  (hidden comment: 49.9 OHMS;.06W;1%;200PPM;FILM;CHIP;0402)
R599  value 39.2  [RES-2010-N]  (hidden comment: 39.2 OHM;.75W;1%;100PPM;FILM CHIP;2010)
R600  value 49.9  [RES-0402-N]  (hidden comment: 49.9 OHMS;.06W;1%;200PPM;FILM;CHIP;0402)
R601  value 49.9  [RES-0402-N]  (hidden comment: 49.9 OHMS;.06W;1%;200PPM;FILM;CHIP;0402)
R602  value 49.9  [RES-0402-N]  (hidden comment: 49.9 OHMS;.06W;1%;200PPM;FILM;CHIP;0402)
R603  value 49.9  [RES-0402-N]  (hidden comment: 49.9 OHMS;.06W;1%;200PPM;FILM;CHIP;0402)
R604  value 49.9  [RES-0402-N]  (hidden comment: 49.9 OHMS;.06W;1%;200PPM;FILM;CHIP;0402)
R605  value 49.9  [RES-0402-N]  (hidden comment: 49.9 OHMS;.06W;1%;200PPM;FILM;CHIP;0402)
R616  value 24.9  [RES-0402-N]  (hidden comment: 24.9 OHMS;.06W;1%;200PPM;FILM;CHIP;0402)
R617  value 24.9  [RES-0402-N]  (hidden comment: 24.9 OHMS;.06W;1%;200PPM;FILM;CHIP;0402)
R618  value 24.9  [RES-0402-N]  (hidden comment: 24.9 OHMS;.06W;1%;200PPM;FILM;CHIP;0402)
R619  value 24.9  [RES-0402-N]  (hidden comment: 24.9 OHMS;.06W;1%;200PPM;FILM;CHIP;0402)
R620  value 24.9  [RES-0402-N]  (hidden comment: 24.9 OHMS;.06W;1%;200PPM;FILM;CHIP;0402)
R621  value 24.9  [RES-0402-N]  (hidden comment: 24.9 OHMS;.06W;1%;200PPM;FILM;CHIP;0402)
R622  value 24.9  [RES-0402-N]  (hidden comment: 24.9 OHMS;.06W;1%;200PPM;FILM;CHIP;0402)
R623  value 24.9  [RES-0402-N]  (hidden comment: 24.9 OHMS;.06W;1%;200PPM;FILM;CHIP;0402)
R624  value 24.9  [RES-0402-N]  (hidden comment: 24.9 OHMS;.06W;1%;200PPM;FILM;CHIP;0402)
R625  value 24.9  [RES-0402-N]  (hidden comment: 24.9 OHMS;.06W;1%;200PPM;FILM;CHIP;0402)
R626  value 24.9  [RES-0402-N]  (hidden comment: 24.9 OHMS;.06W;1%;200PPM;FILM;CHIP;0402)
R627  value 24.9  [RES-0402-N]  (hidden comment: 24.9 OHMS;.06W;1%;200PPM;FILM;CHIP;0402)
R628  value 24.9  [RES-0402-N]  (hidden comment: 24.9 OHMS;.06W;1%;200PPM;FILM;CHIP;0402)
R629  value 24.9  [RES-0402-N]  (hidden comment: 24.9 OHMS;.06W;1%;200PPM;FILM;CHIP;0402)
R630  value 24.9  [RES-0402-N]  (hidden comment: 24.9 OHMS;.06W;1%;200PPM;FILM;CHIP;0402)
R631  value 24.9  [RES-0402-N]  (hidden comment: 24.9 OHMS;.06W;1%;200PPM;FILM;CHIP;0402)
R632  value 24.9  [RES-0402-N]  (hidden comment: 24.9 OHMS;.06W;1%;200PPM;FILM;CHIP;0402)
R633  value 24.9  [RES-0402-N]  (hidden comment: 24.9 OHMS;.06W;1%;200PPM;FILM;CHIP;0402)
R634  value 24.9  [RES-0402-N]  (hidden comment: 24.9 OHMS;.06W;1%;200PPM;FILM;CHIP;0402)
R635  value 24.9  [RES-0402-N]  (hidden comment: 24.9 OHMS;.06W;1%;200PPM;FILM;CHIP;0402)
R636  value 20  [RES-0201-N]  (hidden comment: 20 OHMS;.05W;1%;200PPM;FILM CHIP;0201)
R637  value 20  [RES-0201-N]  (hidden comment: 20 OHMS;.05W;1%;200PPM;FILM CHIP;0201)
R638  value 24.9  [RES-0402-N]  (hidden comment: 24.9 OHMS;.06W;1%;200PPM;FILM;CHIP;0402)
R639  value 24.9  [RES-0402-N]  (hidden comment: 24.9 OHMS;.06W;1%;200PPM;FILM;CHIP;0402)
R640  value 24.9  [RES-0402-N]  (hidden comment: 24.9 OHMS;.06W;1%;200PPM;FILM;CHIP;0402)
R641  value 24.9  [RES-0402-N]  (hidden comment: 24.9 OHMS;.06W;1%;200PPM;FILM;CHIP;0402)
R642  value 24.9  [RES-0402-N]  (hidden comment: 24.9 OHMS;.06W;1%;200PPM;FILM;CHIP;0402)
R643  value 24.9  [RES-0402-N]  (hidden comment: 24.9 OHMS;.06W;1%;200PPM;FILM;CHIP;0402)
R644  value 24.9  [RES-0402-N]  (hidden comment: 24.9 OHMS;.06W;1%;200PPM;FILM;CHIP;0402)
R645  value 24.9  [RES-0402-N]  (hidden comment: 24.9 OHMS;.06W;1%;200PPM;FILM;CHIP;0402)
R646  value 24.9  [RES-0402-N]  (hidden comment: 24.9 OHMS;.06W;1%;200PPM;FILM;CHIP;0402)
R647  value 24.9  [RES-0402-N]  (hidden comment: 24.9 OHMS;.06W;1%;200PPM;FILM;CHIP;0402)
R648  value 24.9  [RES-0402-N]  (hidden comment: 24.9 OHMS;.06W;1%;200PPM;FILM;CHIP;0402)
R649  value 24.9  [RES-0402-N]  (hidden comment: 24.9 OHMS;.06W;1%;200PPM;FILM;CHIP;0402)
U1  MIXER;UP CONV;5-3500MHZ IF IN;5-4200MHZ LO/RF;CD542;RoHS  [CD542]  (value not drawn)
U2  AMP;0-6GHZ;20DB;+20DBM;5V;100MA;SOT-89  [SOT-89]  (value not drawn)
U5  M_PN: HMC232LP4E  [QFN-24_HITTITE]  (hidden comment: MMIC SPDT;NON-REFLECTIVE;SWITCH;DC -12 GHz;RoHS)
U6  M_PN: HMC232LP4E  [QFN-24_HITTITE]  (hidden comment: MMIC SPDT;NON-REFLECTIVE;SWITCH;DC -12 GHz;RoHS)
U11  AMP;0-6GHZ;20DB;+20DBM;5V;100MA;SOT-89  [SOT-89]  (value not drawn)
U12  M_PN: HMC232LP4E  [QFN-24_HITTITE]  (hidden comment: MMIC SPDT;NON-REFLECTIVE;SWITCH;DC -12 GHz;RoHS)
U14  M_PN: MASWCC0006  [QFN36_MACOM]  (hidden comment: SWITCH;SP6T;DC-4GHZ;25DB ISO;20NS;27DBM P1;PQFN-36)
U16  M_PN: MASWCC0006  [QFN36_MACOM]  (hidden comment: SWITCH;SP6T;DC-4GHZ;25DB ISO;20NS;27DBM P1;PQFN-36)
U19  M_PN: HMC232LP4E  [QFN-24_HITTITE]  (hidden comment: MMIC SPDT;NON-REFLECTIVE;SWITCH;DC -12 GHz;RoHS)
U21  M_PN: HMC232LP4E  [QFN-24_HITTITE]  (hidden comment: MMIC SPDT;NON-REFLECTIVE;SWITCH;DC -12 GHz;RoHS)
U24  M_PN: HMC232LP4E  [QFN-24_HITTITE]  (hidden comment: MMIC SPDT;NON-REFLECTIVE;SWITCH;DC -12 GHz;RoHS)
U109  M_PN: HMC232LP4E  [QFN-24_HITTITE]  (hidden comment: MMIC SPDT;NON-REFLECTIVE;SWITCH;DC -12 GHz;RoHS)
U113  M_PN: HMC232LP4E  [QFN-24_HITTITE]  (hidden comment: MMIC SPDT;NON-REFLECTIVE;SWITCH;DC -12 GHz;RoHS)
U126  M_PN: HMC232LP4E  [QFN-24_HITTITE]  (hidden comment: MMIC SPDT;NON-REFLECTIVE;SWITCH;DC -12 GHz;RoHS)
U133  AMP;0-6GHZ;20DB;+20DBM;5V;100MA;SOT-89  [SOT-89]  (value not drawn)
U134  M_PN: HMC232LP4E  [QFN-24_HITTITE]  (hidden comment: MMIC SPDT;NON-REFLECTIVE;SWITCH;DC -12 GHz;RoHS)
U135  M_PN: HMC232LP4E  [QFN-24_HITTITE]  (hidden comment: MMIC SPDT;NON-REFLECTIVE;SWITCH;DC -12 GHz;RoHS)
U136  M_PN: HMC232LP4E  [QFN-24_HITTITE]  (hidden comment: MMIC SPDT;NON-REFLECTIVE;SWITCH;DC -12 GHz;RoHS)

## Ports
200_MHz_Comb, 2400MHz_Stalo, SRD_BANK_1_NEG, SRD_BANK_1_POS, SRD_BANK_2_NEG, SRD_BANK_2_POS, SRD_BANK_3_NEG, SRD_BANK_3_POS, SRD_BANK_4_NEG, SRD_BANK_4_POS, SRD_BANK_5_NEG, SRD_BANK_5_POS, SRD_BANK_6_NEG, SRD_BANK_6_POS, STALO_LO, ~{SRD_BANK_1_NEG}, ~{SRD_BANK_2_NEG}, ~{SRD_BANK_3_NEG}, ~{SRD_BANK_4_NEG}, ~{SRD_BANK_5_NEG}, ~{SRD_BANK_6_NEG}

## Nets
+5V_ST: C388.1 C741.1 C742.1 C930.2 FT17.1 L138.1 L218.2
+8V_ST: C2.1 C3.1 C768.1 C770.2 C771.2 C811.1 C816.1 FT32.1 R4.1 R171.1 R599.2
-5V_ST: C436.1 C743.1 C747.1 C919.2 FT6.1 L167.1 L212.2
GND: AT1.2(GND) AT3.2(GND) AT6.2(GND) AT10.2(GND) AT12.2(GND) AT14.2(GND) AT43.2(GND) AT44.2(GND) AT45.2(GND) AT46.2(GND) AT47.2(GND) AT48.2(GND) AT49.2(GND) AT50.2(GND) AT51.2(GND) AT52.2(GND) AT56.2(GND) AT72.2(GND) C1.2 C2.2 C3.2 C4.1 C9.1 C11.1 C13.2 C14.2 C15.1 C142.1 C143.2 C144.2 C145.2 C146.2 C147.2 C187.1 C387.2 C388.2 C389.2 C390.2 C391.2 C392.2 C436.2 C437.2 C438.2 C439.2 C717.1 C741.2 C742.2 C743.2 C747.2 C754.2 C755.2 C756.2 C757.2 C758.2 C759.2 C760.2 C761.2 C762.2 C763.2 C764.2 C765.2 C766.1 C767.2 C768.2 C769.1 C770.1 C771.1 C778.2 C779.2 C785.2 C786.2 C791.2 C792.2 C797.2 C798.2 C803.2 C804.2 C809.2 C810.2 C811.2 C812.2 C813.1 C814.1 C815.1 C816.2 C818.2 C894.2 C895.2 C896.2 C897.2 C898.2 C899.2 C900.2 C901.2 C902.2 C903.2 C904.2 C905.2 C906.2 C907.2 C908.2 C909.2 C910.2 C911.2 C912.2 C913.2 C914.2 C915.2 C916.2 C917.2 C918.2 C919.1 C920.2 C921.1 C922.2 C923.1 C924.2 C925.1 C926.2 C927.1 C928.2 C929.1 C930.1 C931.1 C932.1 C933.2 C934.2 C935.1 C936.2 C937.1 C938.2 C939.1 C940.2 C941.2 C942.2 C943.1 C944.1 C945.1 FL1.2(GND) FL2.2(GND) FL3.2(GND) FL4.2(GND) FL4.4(GND) FL4.5(GND) FL4.6(GND) FL7.3 FL7.4 FL7.5 FL7.6 FL7.7 FL7.8 FL7.9 FL7.10 FL7.11 FL7.12 FL8.3 FL8.4 FL8.5 FL8.6 FL8.7 FL8.8 FL8.9 FL8.10 FL8.11 FL8.12 FL16.3 FL16.4 FL16.5 FL16.6 FL16.7 FL16.8 FL16.9 FL16.10 FL16.11 FL16.12 FL17.3 FL17.4 FL17.5 FL17.6 FL17.7 FL17.8 FL17.9 FL17.10 FL17.11 FL17.12 FL24.3 FL24.4 FL24.5 FL24.6 FL24.7 FL24.8 FL24.9 FL24.10 FL24.11 FL24.12 FL25.3 FL25.4 FL25.5 FL25.6 FL25.7 FL25.8 FL25.9 FL25.10 FL25.11 FL25.12 FL30.3 FL30.4 FL30.5 FL30.6 FL30.7 FL30.8 FL30.9 FL30.10 FL30.11 FL30.12 FL31.3 FL31.4 FL31.5 FL31.6 FL31.7 FL31.8 FL31.9 FL31.10 FL31.11 FL31.12 FL35.3 FL35.4 FL35.5 FL35.6 FL35.7 FL35.8 FL35.9 FL35.10 FL35.11 FL35.12 FL36.3 FL36.4 FL36.5 FL36.6 FL36.7 FL36.8 FL36.9 FL36.10 FL36.11 FL36.12 FL40.3 FL40.4 FL40.5 FL40.6 FL40.7 FL40.8 FL40.9 FL40.10 FL40.11 FL40.12 FL41.3 FL41.4 FL41.5 FL41.6 FL41.7 FL41.8 FL41.9 FL41.10 FL41.11 FL41.12 FL93.2(GND) FL93.4(GND) FL143.2(GND) FL144.2(GND) FL145.2(GND) FL146.2(OUT) FL146.4(GND) FL147.2(GND) FL148.2(GND) FL149.2(GND) FL150.2(OUT) FL150.4(GND) J23.2(GND) J24.2(GND) L6.1 L7.1 L46.1 L52.1 L53.1 L58.1 L60.1 L61.1 L62.1 L63.1 L64.1 L70.1 L72.1 L74.1 L75.1 L80.1 L81.1 L82.1 L83.1 L86.1 L87.1 L92.1 L93.1 L94.1 L95.1 L97.1 R1.2 R3.2 R401.2 R596.2 R597.2 R598.2 R600.2 R601.2 R602.2 R603.2 R604.2 R605.2 U1.1(GND) U1.4(GND) U1.5(GND) U2.2(GND) U2.4 U5.1(Vdd) U5.2(Vctl) U5.3(G) U5.5(G) U5.6(NC) U5.7(NC) U5.8(G) U5.10(G) U5.11(NC) U5.12(RF2) U5.13(NC) U5.14(NC) U5.17(NC) U5.18(NC) U5.19(NC) U5.20(NC) U5.21(G) U5.23(G) U5.24(NC) U5.25(G) U6.1(Vdd) U6.2(Vctl) U6.3(G) U6.5(G) U6.6(NC) U6.7(NC) U6.8(G) U6.10(G) U6.11(NC) U6.12(RF2) U6.13(NC) U6.14(NC) U6.17(NC) U6.18(NC) U6.19(NC) U6.20(NC) U6.21(G) U6.23(G) U6.24(NC) U6.25(G) U11.2(GND) U11.4 U12.1(Vdd) U12.2(Vctl) U12.3(G) U12.5(G) U12.6(NC) U12.7(NC) U12.8(G) U12.10(G) U12.11(NC) U12.12(RF2) U12.13(NC) U12.14(NC) U12.17(NC) U12.18(NC) U12.19(NC) U12.20(NC) U12.21(G) U12.23(G) U12.24(NC) U12.25(G) U14.11(GND) U14.13(GND) U14.15(GND) U14.17(GND) U14.19(GND) U14.21(GND) U14.23(GND) U14.24(GND) U14.26(GND) U14.28(GND) U14.30(GND) U14.37(GND) U16.11(GND) U16.13(GND) U16.15(GND) U16.17(GND) U16.19(GND) U16.21(GND) U16.23(GND) U16.24(GND) U16.26(GND) U16.28(GND) U16.30(GND) U16.37(GND) U19.1(Vdd) U19.2(Vctl) U19.3(G) U19.5(G) U19.6(NC) U19.7(NC) U19.8(G) U19.10(G) U19.11(NC) U19.12(RF2) U19.13(NC) U19.14(NC) U19.17(NC) U19.18(NC) U19.19(NC) U19.20(NC) U19.21(G) U19.23(G) U19.24(NC) U19.25(G) U21.1(Vdd) U21.2(Vctl) U21.3(G) U21.5(G) U21.6(NC) U21.7(NC) U21.8(G) U21.10(G) U21.11(NC) U21.12(RF2) U21.13(NC) U21.14(NC) U21.17(NC) U21.18(NC) U21.19(NC) U21.20(NC) U21.21(G) U21.23(G) U21.24(NC) U21.25(G) U24.1(Vdd) U24.2(Vctl) U24.3(G) U24.5(G) U24.6(NC) U24.7(NC) U24.8(G) U24.10(G) U24.11(NC) U24.12(RF2) U24.13(NC) U24.14(NC) U24.17(NC) U24.18(NC) U24.19(NC) U24.20(NC) U24.21(G) U24.23(G) U24.24(NC) U24.25(G) U109.1(Vdd) U109.2(Vctl) U109.3(G) U109.5(G) U109.6(NC) U109.7(NC) U109.8(G) U109.10(G) U109.11(NC) U109.12(RF2) U109.13(NC) U109.14(NC) U109.17(NC) U109.18(NC) U109.19(NC) U109.20(NC) U109.21(G) U109.23(G) U109.24(NC) U109.25(G) U113.1(Vdd) U113.2(Vctl) U113.3(G) U113.5(G) U113.6(NC) U113.7(NC) U113.8(G) U113.10(G) U113.11(NC) U113.12(RF2) U113.13(NC) U113.14(NC) U113.17(NC) U113.18(NC) U113.19(NC) U113.20(NC) U113.21(G) U113.23(G) U113.24(NC) U113.25(G) U126.1(Vdd) U126.2(Vctl) U126.3(G) U126.5(G) U126.6(NC) U126.7(NC) U126.8(G) U126.10(G) U126.11(NC) U126.12(RF2) U126.13(NC) U126.14(NC) U126.17(NC) U126.18(NC) U126.19(NC) U126.20(NC) U126.21(G) U126.23(G) U126.24(NC) U126.25(G) U133.2(GND) U133.4 U134.1(Vdd) U134.2(Vctl) U134.3(G) U134.5(G) U134.6(NC) U134.7(NC) U134.8(G) U134.10(G) U134.11(NC) U134.12(RF2) U134.13(NC) U134.14(NC) U134.17(NC) U134.18(NC) U134.19(NC) U134.20(NC) U134.21(G) U134.23(G) U134.24(NC) U134.25(G) U135.1(Vdd) U135.2(Vctl) U135.3(G) U135.5(G) U135.6(NC) U135.7(NC) U135.8(G) U135.10(G) U135.11(NC) U135.12(RF2) U135.13(NC) U135.14(NC) U135.17(NC) U135.18(NC) U135.19(NC) U135.20(NC) U135.21(G) U135.23(G) U135.24(NC) U135.25(G) U136.1(Vdd) U136.2(Vctl) U136.3(G) U136.5(G) U136.6(NC) U136.7(NC) U136.8(G) U136.10(G) U136.11(NC) U136.12(RF2) U136.13(NC) U136.14(NC) U136.17(NC) U136.18(NC) U136.19(NC) U136.20(NC) U136.21(G) U136.23(G) U136.24(NC) U136.25(G)
200_MHz_Comb: L2.1 ; port 200_MHz_Comb
2400MHz_Stalo: U1.6(L) ; port 2400MHz_Stalo
~{SRD_BANK_1_NEG}: C764.1 C797.1 R622.1 R624.1 ; port ~{SRD_BANK_1_NEG}
~{SRD_BANK_2_NEG}: C898.1 C900.1 R626.1 R628.1 ; port ~{SRD_BANK_2_NEG}
~{SRD_BANK_3_NEG}: C760.1 C762.1 R618.1 R620.1 ; port ~{SRD_BANK_3_NEG}
~{SRD_BANK_4_NEG}: C906.1 C908.1 R630.1 R632.1 ; port ~{SRD_BANK_4_NEG}
~{SRD_BANK_5_NEG}: C754.1 C896.1 R319.1 R616.1 ; port ~{SRD_BANK_5_NEG}
~{SRD_BANK_6_NEG}: C914.1 C916.1 R634.1 R636.1 ; port ~{SRD_BANK_6_NEG}
SRD_BANK_1_NEG: C792.1 C798.1 R623.1 R625.1 ; port SRD_BANK_1_NEG
SRD_BANK_1_POS: C938.1 C940.1 L222.1 L223.1 ; port SRD_BANK_1_POS
SRD_BANK_2_NEG: C899.1 C901.1 R627.1 R629.1 ; port SRD_BANK_2_NEG
SRD_BANK_2_POS: C918.1 C928.1 L217.1 L219.1 ; port SRD_BANK_2_POS
SRD_BANK_3_NEG: C761.1 C763.1 R619.1 R621.1 ; port SRD_BANK_3_NEG
SRD_BANK_3_POS: C941.1 L224.1 R183.2 ; port SRD_BANK_3_POS
SRD_BANK_4_NEG: C907.1 C909.1 R631.1 R633.1 ; port SRD_BANK_4_NEG
SRD_BANK_4_POS: C926.1 L216.1 R178.2 ; port SRD_BANK_4_POS
SRD_BANK_5_NEG: C895.1 C897.1 R322.1 R617.1 ; port SRD_BANK_5_NEG
SRD_BANK_5_POS: C942.1 L225.1 R182.2 ; port SRD_BANK_5_POS
SRD_BANK_6_NEG: C915.1 C917.1 R635.1 R637.1 ; port SRD_BANK_6_NEG
SRD_BANK_6_POS: C924.1 L215.1 R180.2 ; port SRD_BANK_6_POS
STALO_LO: AT56.1(IN/OUT) ; port STALO_LO
NetAT1_1: AT1.1(IN/OUT) FL7.1 L58.2
NetAT1_3: AT1.3(IN/OUT) FL8.2 L53.2
NetAT3_1: AT3.1(IN/OUT) FL16.1 L61.2
NetAT3_3: AT3.3(IN/OUT) FL17.2 L63.2
NetAT6_1: AT6.1(IN/OUT) FL24.1 L70.2
NetAT6_3: AT6.3(IN/OUT) FL25.2 L74.2
NetAT10_1: AT10.1(IN/OUT) FL30.1 L80.2
NetAT10_3: AT10.3(IN/OUT) FL31.2 L82.2
NetAT12_1: AT12.1(IN/OUT) FL35.1 L86.2
NetAT12_3: AT12.3(IN/OUT) FL36.2 L92.2
NetAT14_1: AT14.1(IN/OUT) FL41.1 L94.2
NetAT14_3: AT14.3(IN/OUT) FL40.2 L97.2
NetAT43_1: AT43.1(IN/OUT) FL4.3(OUT)
NetAT43_3: AT43.3(IN/OUT) U1.3(R)
NetAT44_1: AT44.1(IN/OUT) U1.2(I)
NetAT44_3: AT44.3(IN/OUT) L3.2
NetAT45_1: AT45.1(IN/OUT) FL4.1(IN)
NetAT45_3: AT45.3(IN/OUT) FL93.1(IN)
NetAT46_1: AT46.1(IN/OUT) FL93.3(OUT)
NetAT46_3: AT46.3(IN/OUT) C10.1
NetAT47_1: AT47.1(IN/OUT) FL8.1 L52.2
NetAT47_3: AT47.3(IN/OUT) C777.1
NetAT48_1: AT48.1(IN/OUT) FL17.1 L62.2
NetAT48_3: AT48.3(IN/OUT) C784.1
NetAT49_1: AT49.1(IN/OUT) FL25.1 L72.2
NetAT49_3: AT49.3(IN/OUT) C790.1
NetAT50_1: AT50.1(IN/OUT) FL31.1 L81.2
NetAT50_3: AT50.3(IN/OUT) C796.1
NetAT51_1: AT51.1(IN/OUT) FL36.1 L87.2
NetAT51_3: AT51.3(IN/OUT) C802.1
NetAT52_1: AT52.1(IN/OUT) FL40.1 L95.2
NetAT52_3: AT52.3(IN/OUT) C808.1
NetAT56_3: AT56.3(IN/OUT) C360.2
NetAT72_1: AT72.1(IN/OUT) C773.2
NetAT72_3: AT72.3(IN/OUT) C731.1
NetC1_1: C1.1 FL3.1(IN) L205.1
NetC4_2: C4.2 FL1.1(IN) FL2.3(OUT)
NetC5_1: C5.1 C789.2 L99.2 U133.3
NetC5_2: C5.2 U14.22(RFC)
NetC6_1: C6.1 C8.2 C9.2 L7.2
NetC6_2: C6.2 L4.2
NetC7_1: C7.1 C11.2 L4.1 L6.2
NetC7_2: C7.2 L2.2
NetC8_1: C8.1 L3.1
NetC10_2: C10.2 U133.1
NetC13_1: C13.1 L99.1 L205.2
NetC14_1: C14.1 L100.2 L117.1
NetC15_2: C15.2 FL149.1(IN) L118.1
NetC142_2: C142.2 C933.1 R638.2 U16.9(C1)
NetC143_1: C143.1 C921.2 R639.2 U16.8(C2)
NetC144_1: C144.1 C923.2 R640.2 U16.7(C3)
NetC145_1: C145.1 C935.2 R644.2 U16.6(C4)
NetC146_1: C146.1 C937.2 R645.2 U16.5(C5)
NetC147_1: C147.1 C939.2 R646.2 U16.4(C6)
NetC187_2: C187.2 FL1.3(OUT) R599.1
NetC360_1: C360.1 C820.2 C821.1
NetC387_1: C387.1 L138.2 U14.33(VCC)
NetC389_1: C389.1 L167.2 U14.32(VEE)
NetC390_1: C390.1 C925.2 R641.2 U14.6(C4)
NetC391_1: C391.1 C944.2 R648.2 U14.8(C2)
NetC392_1: C392.1 C945.2 R649.2 U14.7(C3)
NetC437_1: C437.1 C927.2 R642.2 U14.5(C5)
NetC438_1: C438.1 C929.2 R643.2 U14.4(C6)
NetC439_1: C439.1 C943.2 R647.2 U14.9(C1)
NetC717_2: C717.2 FL2.1(IN) FL3.3(OUT)
NetC731_2: C731.2 U11.1
NetC732_1: C732.1 U14.18(RF3)
NetC732_2: C732.2 U5.9(RF1)
NetC733_1: C733.1 U5.4(NC)
NetC733_2: C733.2 FL7.2 L46.2
NetC736_1: C736.1 U6.4(NC)
NetC736_2: C736.2 FL16.2 L60.2
NetC738_1: C738.1 U14.14(RF1)
NetC738_2: C738.2 U12.9(RF1)
NetC739_1: C739.1 U12.4(NC)
NetC739_2: C739.2 FL24.2 L64.2
NetC744_1: C744.1 U14.29(RF6)
NetC744_2: C744.2 U19.9(RF1)
NetC745_1: C745.1 U19.4(NC)
NetC745_2: C745.2 FL30.2 L75.2
NetC748_1: C748.1 U14.27(RF5)
NetC748_2: C748.2 U21.9(RF1)
NetC749_1: C749.1 U21.4(NC)
NetC749_2: C749.2 FL35.2 L83.2
NetC751_1: C751.1 U14.25(RF4)
NetC751_2: C751.2 U24.9(RF1)
NetC752_1: C752.1 U24.4(NC)
NetC752_2: C752.2 FL41.2 L93.2
NetC755_1: C755.1 L96.2 U5.16(A)
NetC756_1: C756.1 L103.2 U6.15(B)
NetC757_1: C757.1 L104.2 U6.16(A)
NetC758_1: C758.1 L105.2 U113.15(B)
NetC759_1: C759.1 L106.2 U113.16(A)
NetC765_1: C765.1 L107.2 U12.15(B)
NetC766_2: C766.2 FL143.1(IN) FL144.3(OUT)
NetC767_1: C767.1 FL143.3(OUT) R4.2
NetC769_2: C769.2 FL144.1(IN) FL145.3(OUT)
NetC772_1: C772.1 U16.22(RFC)
NetC772_2: C772.2 FL146.1(IN)
NetC773_1: C773.1 L117.2 U2.3
NetC774_1: C774.1 FL146.3(GND)
NetC774_2: C774.2 U2.1
NetC775_1: C775.1 U109.4(NC)
NetC775_2: C775.2 U16.25(RF4)
NetC777_2: C777.2 U109.9(RF1)
NetC778_1: C778.1 L98.2 U109.15(B)
NetC779_1: C779.1 L102.2 U109.16(A)
NetC781_1: C781.1 U113.4(NC)
NetC781_2: C781.2 U16.27(RF5)
NetC783_1: C783.1 U14.16(RF2)
NetC783_2: C783.2 U6.9(RF1)
NetC784_2: C784.2 U113.9(RF1)
NetC785_1: C785.1 L108.2 U12.16(A)
NetC786_1: C786.1 L109.2 U126.15(B)
NetC788_1: C788.1 U126.4(NC)
NetC788_2: C788.2 U16.29(RF6)
NetC789_1: C789.1 J23.1(CNTR)
NetC790_2: C790.2 U126.9(RF1)
NetC791_1: C791.1 L110.2 U126.16(A)
NetC794_1: C794.1 U134.4(NC)
NetC794_2: C794.2 U16.14(RF1)
NetC796_2: C796.2 U134.9(RF1)
NetC800_1: C800.1 U135.4(NC)
NetC800_2: C800.2 U16.16(RF2)
NetC802_2: C802.2 U135.9(RF1)
NetC803_1: C803.1 L111.2 U19.15(B)
NetC804_1: C804.1 L112.2 U19.16(A)
NetC806_1: C806.1 U136.4(NC)
NetC806_2: C806.2 U16.18(RF3)
NetC808_2: C808.2 U136.9(RF1)
NetC809_1: C809.1 L113.2 U134.15(B)
NetC810_1: C810.1 L114.2 U134.16(A)
NetC812_1: C812.1 FL147.3(OUT) R171.2
NetC813_2: C813.2 FL147.1(IN) FL148.3(OUT)
NetC814_2: C814.2 FL148.1(IN) FL149.3(OUT)
NetC815_2: C815.2 FL145.1(IN) L100.1
NetC817_1: C817.1 L101.2 U11.3
NetC817_2: C817.2 FL150.1(IN)
NetC818_1: C818.1 L101.1 L118.2
NetC820_1: C820.1 FL150.3(GND)
NetC821_2: C821.2 J24.1(CNTR)
NetC894_1: C894.1 L91.2 U5.15(B)
NetC902_1: C902.1 L115.2 U21.15(B)
NetC903_1: C903.1 L116.2 U21.16(A)
NetC904_1: C904.1 L204.2 U135.15(B)
NetC905_1: C905.1 L207.2 U135.16(A)
NetC910_1: C910.1 L208.2 U24.15(B)
NetC911_1: C911.1 L209.2 U24.16(A)
NetC912_1: C912.1 L210.2 U136.15(B)
NetC913_1: C913.1 L211.2 U136.16(A)
NetC920_1: C920.1 L213.1 R178.1
NetC922_1: C922.1 L214.1 R179.1
NetC931_2: C931.2 L212.1 U16.32(VEE)
NetC932_2: C932.2 L218.1 U16.33(VCC)
NetC934_1: C934.1 L220.1 R181.1
NetC936_1: C936.1 L221.1 R183.1
NetL91_1: L91.1 R319.2
NetL96_1: L96.1 R322.2
NetL98_1: L98.1 R616.2
NetL102_1: L102.1 R617.2
NetL103_1: L103.1 R618.2
NetL104_1: L104.1 R619.2
NetL105_1: L105.1 R620.2
NetL106_1: L106.1 R621.2
NetL107_1: L107.1 R622.2
NetL108_1: L108.1 R623.2
NetL109_1: L109.1 R624.2
NetL110_1: L110.1 R625.2
NetL111_1: L111.1 R626.2
NetL112_1: L112.1 R627.2
NetL113_1: L113.1 R628.2
NetL114_1: L114.1 R629.2
NetL115_1: L115.1 R630.2
NetL116_1: L116.1 R631.2
NetL204_1: L204.1 R632.2
NetL207_1: L207.1 R633.2
NetL208_1: L208.1 R634.2
NetL209_1: L209.1 R635.2
NetL210_1: L210.1 R636.2
NetL211_1: L211.1 R637.2
NetL213_2: L213.2 R639.1
NetL214_2: L214.2 R640.1
NetL215_2: L215.2 R641.1
NetL216_2: L216.2 R642.1
NetL217_2: L217.2 R643.1
NetL219_2: L219.2 R638.1
NetL220_2: L220.2 R644.1
NetL221_2: L221.2 R645.1
NetL222_2: L222.2 R646.1
NetL223_2: L223.2 R647.1
NetL224_2: L224.2 R648.1
NetL225_2: L225.2 R649.1
NetR1_1: R1.1 U5.22(RF2)
NetR3_1: R3.1 U6.22(RF2)
NetR179_2: R179.2 R180.1
NetR181_2: R181.2 R182.1
NetR401_1: R401.1 U12.22(RF2)
NetR596_1: R596.1 U19.22(RF2)
NetR597_1: R597.1 U21.22(RF2)
NetR598_1: R598.1 U24.22(RF2)
NetR600_1: R600.1 U109.22(RF2)
NetR601_1: R601.1 U113.22(RF2)
NetR602_1: R602.1 U126.22(RF2)
NetR603_1: R603.1 U134.22(RF2)
NetR604_1: R604.1 U135.22(RF2)
NetR605_1: R605.1 U136.22(RF2)

Not connected (* = marked no-connect by the designer): U14 1(CP2) 2(VEE) 3(NC) 10(NC) 12(NC) 20(NC) 31(NC) 34(NC) 35(VCC) 36(CP1); U16 1(CP2) 2(VEE) 3(NC) 10(NC) 12(NC) 20(NC) 31(NC) 34(NC) 35(VCC) 36(CP1)

## Layout directives
net class GCPW Clearance: 2400MHz_Stalo, NetAT72_1, NetAT72_3, NetC789_1, NetC821_2
net class 30 mil clearance: NetAT1_1, NetAT1_3, NetAT3_1, NetAT3_3, NetAT6_1, NetAT6_3, NetAT10_1, NetAT10_3, NetAT12_1, NetAT12_3, NetAT14_1, NetAT14_3, NetAT43_1, NetAT43_3, NetAT44_1, NetAT44_3, NetAT45_1, NetAT45_3, NetAT46_1, NetAT46_3, NetAT47_1, NetAT47_3, NetAT48_1, NetAT48_3, NetAT49_1, NetAT49_3, NetAT50_1, NetAT50_3, NetAT51_1, NetAT51_3, NetAT52_1, NetAT52_3, NetAT56_3, NetC6_1, NetC6_2, NetC7_1, NetC7_2, NetC8_1, NetC10_2, NetC360_1, NetC731_2, NetC736_2, NetC739_2, NetC745_2, NetC749_2, NetC752_2, NetC773_1, NetC774_1, NetC774_2, NetC817_1, NetC817_2, NetC820_1, STALO_LO
net class 25 mil clearance: NetC5_1, NetC5_2, NetC732_1, NetC738_1, NetC744_1, NetC748_1, NetC751_1, NetC772_1, NetC772_2, NetC775_2, NetC781_2, NetC783_1, NetC788_2, NetC794_2, NetC800_2, NetC806_2
net class 9.7 mil gap: NetC732_2, NetC733_1, NetC736_1, NetC738_2, NetC739_1, NetC744_2, NetC745_1, NetC748_2, NetC749_1, NetC751_2, NetC752_1, NetC775_1, NetC777_2, NetC781_1, NetC783_2, NetC784_2, NetC788_1, NetC790_2, NetC794_1, NetC796_2, NetC800_1, NetC802_2, NetC806_1, NetC808_2